# Altium schematic sheet INV.Main.SchDoc
size 1549 x 599 mm; SheetNumber: 2; SheetTotal: 3
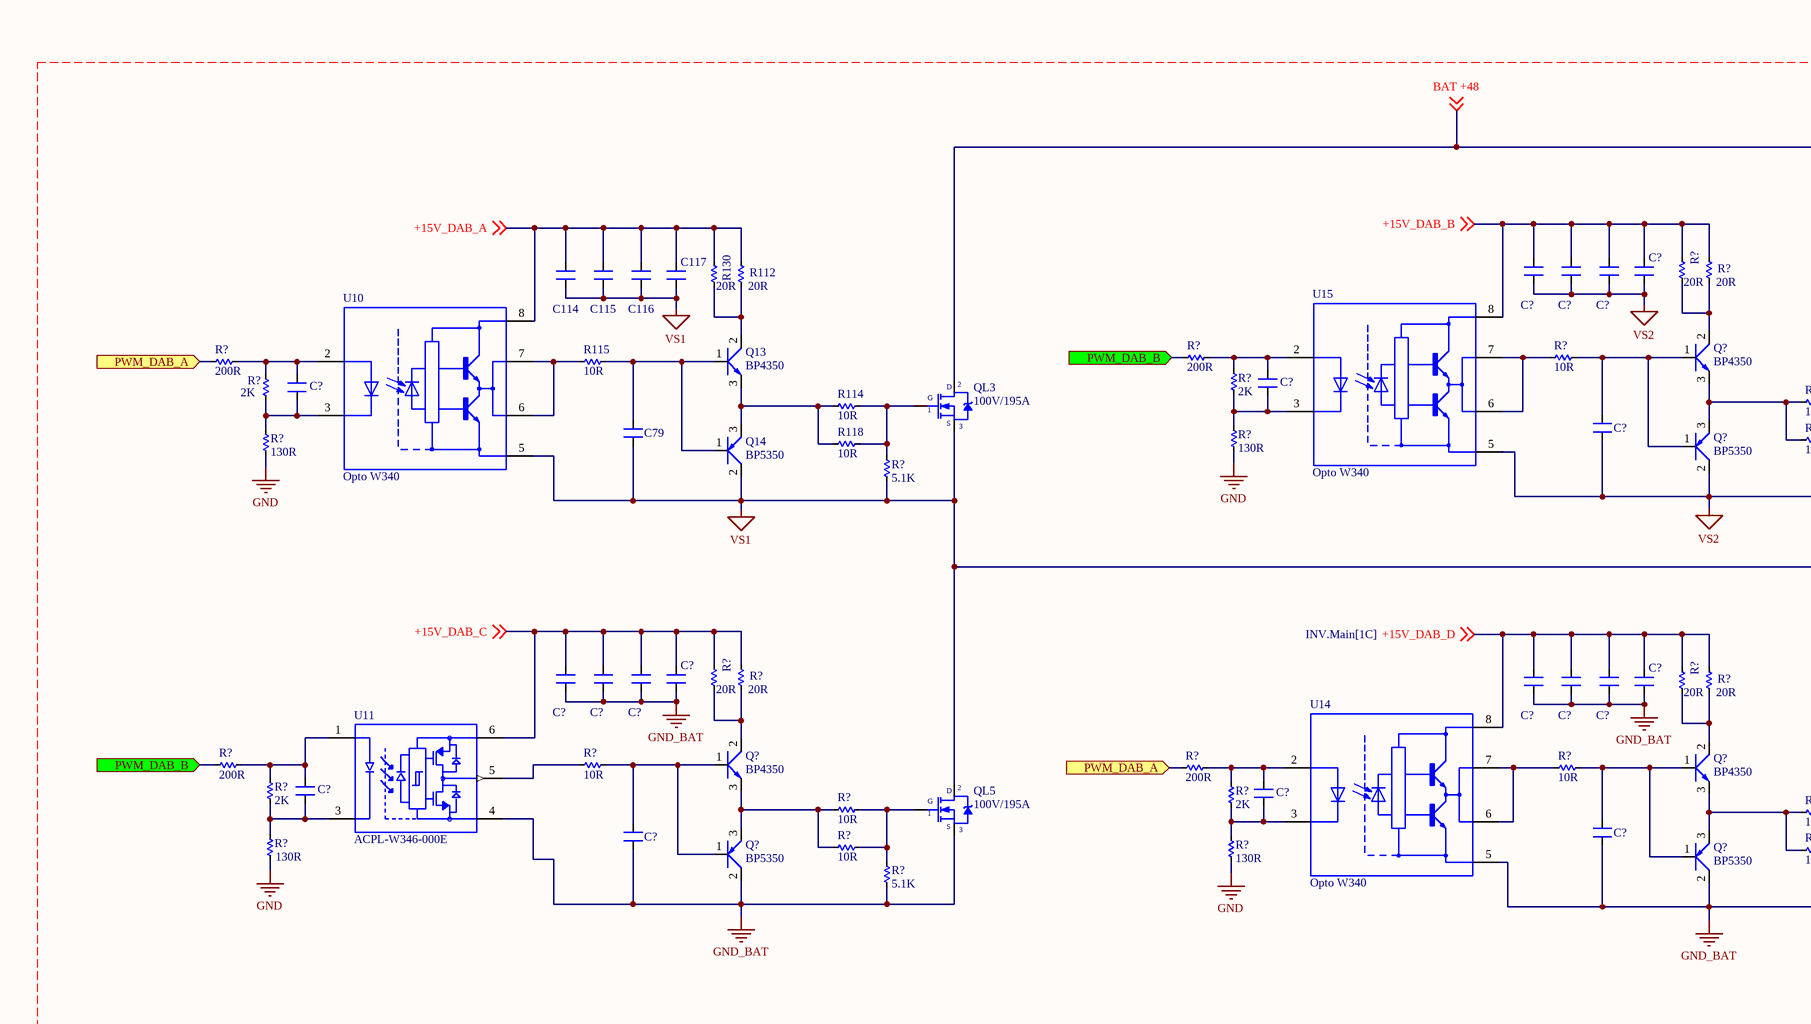
[diagram p0: INV.Main.SchDoc, top column 1 of 4]
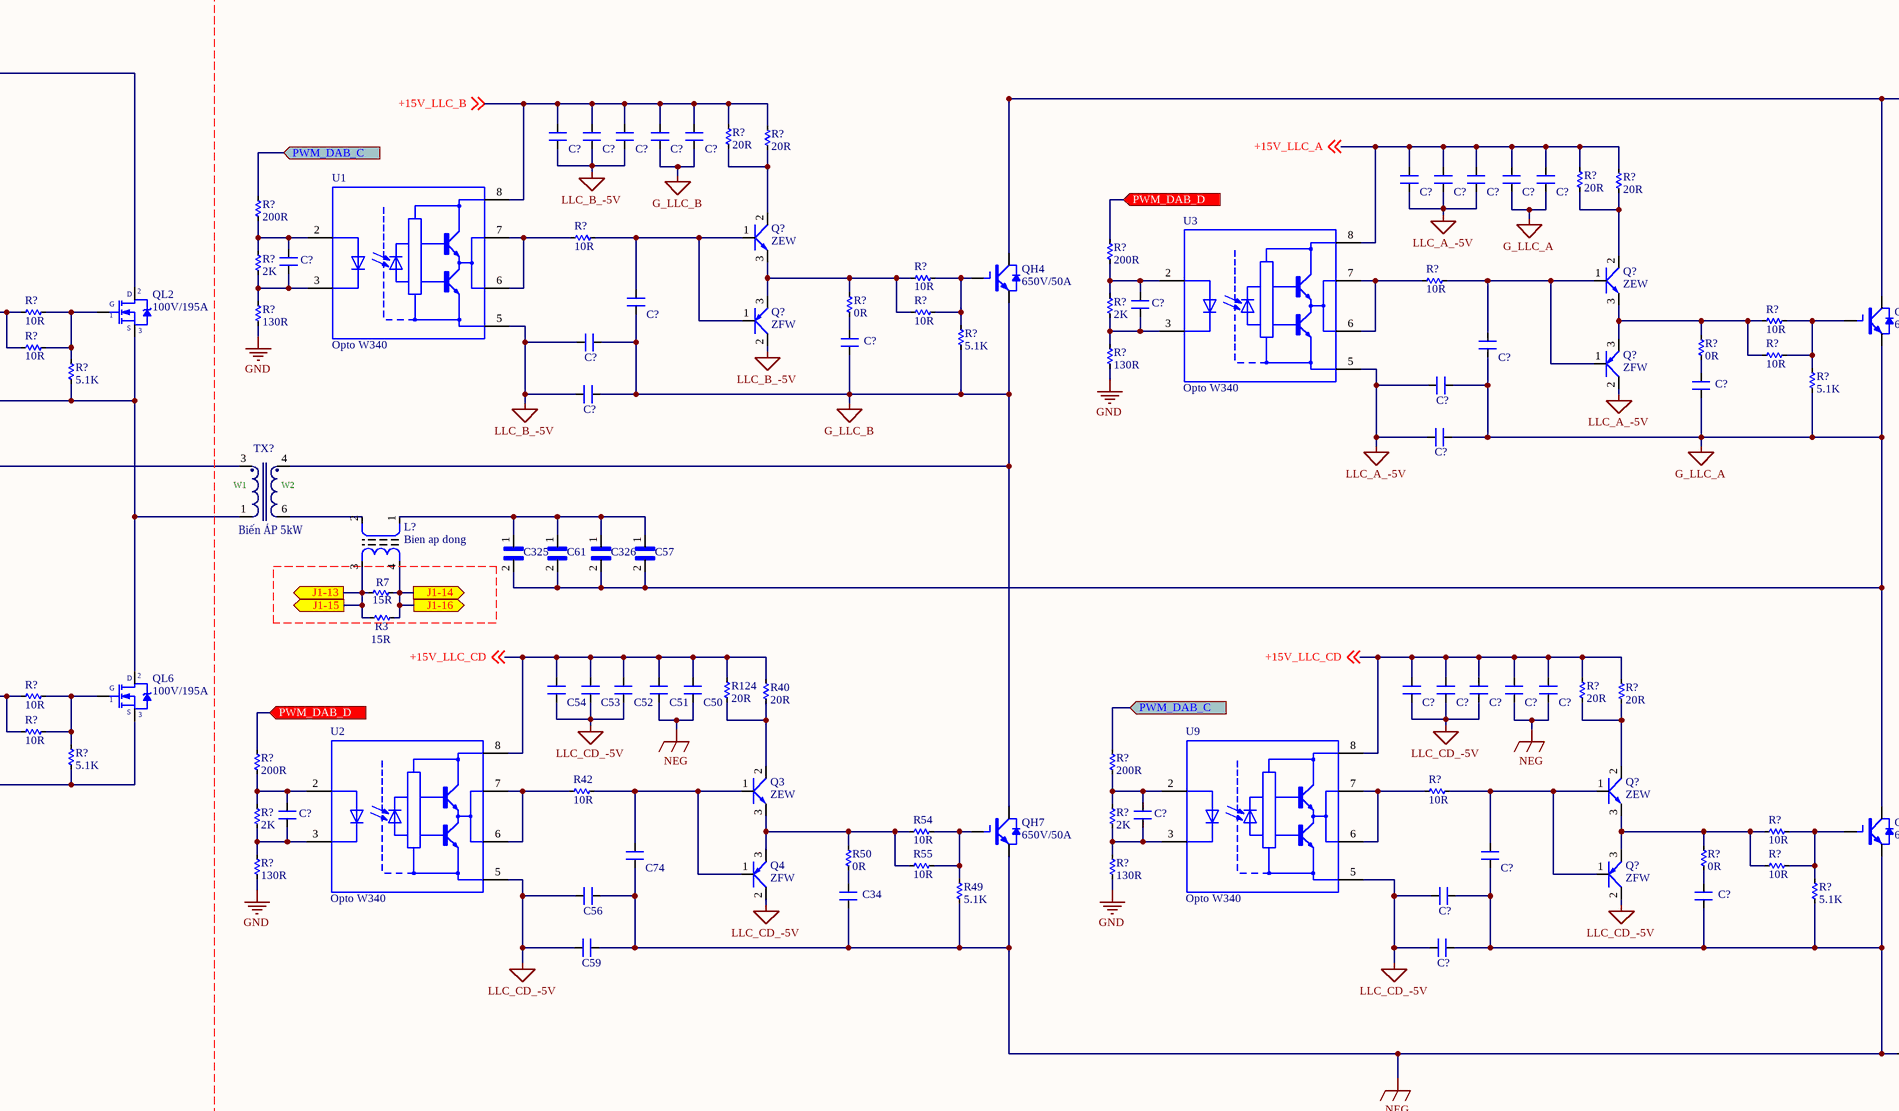
[diagram p1: INV.Main.SchDoc, top column 2 of 4]
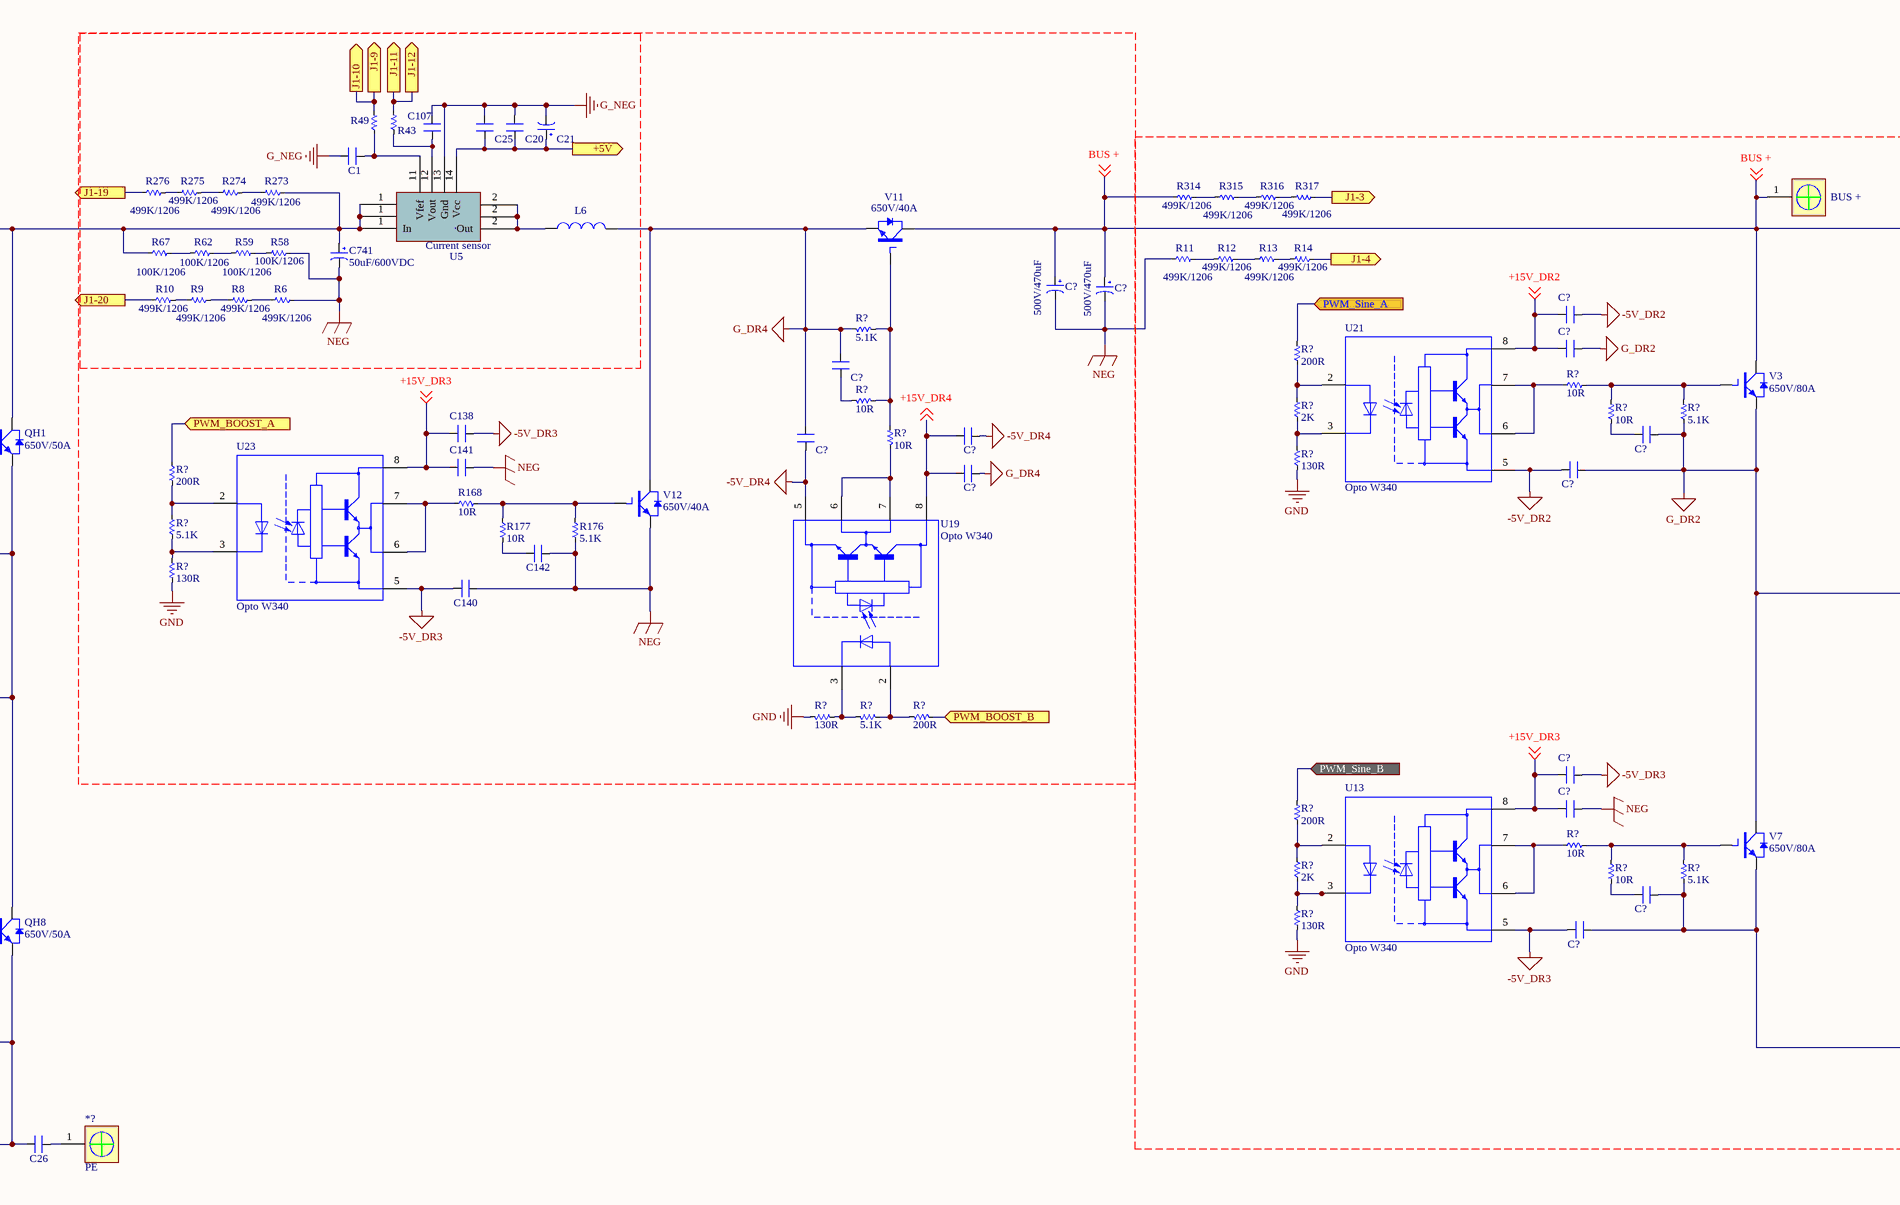
[diagram p2: INV.Main.SchDoc, top column 3 of 4]
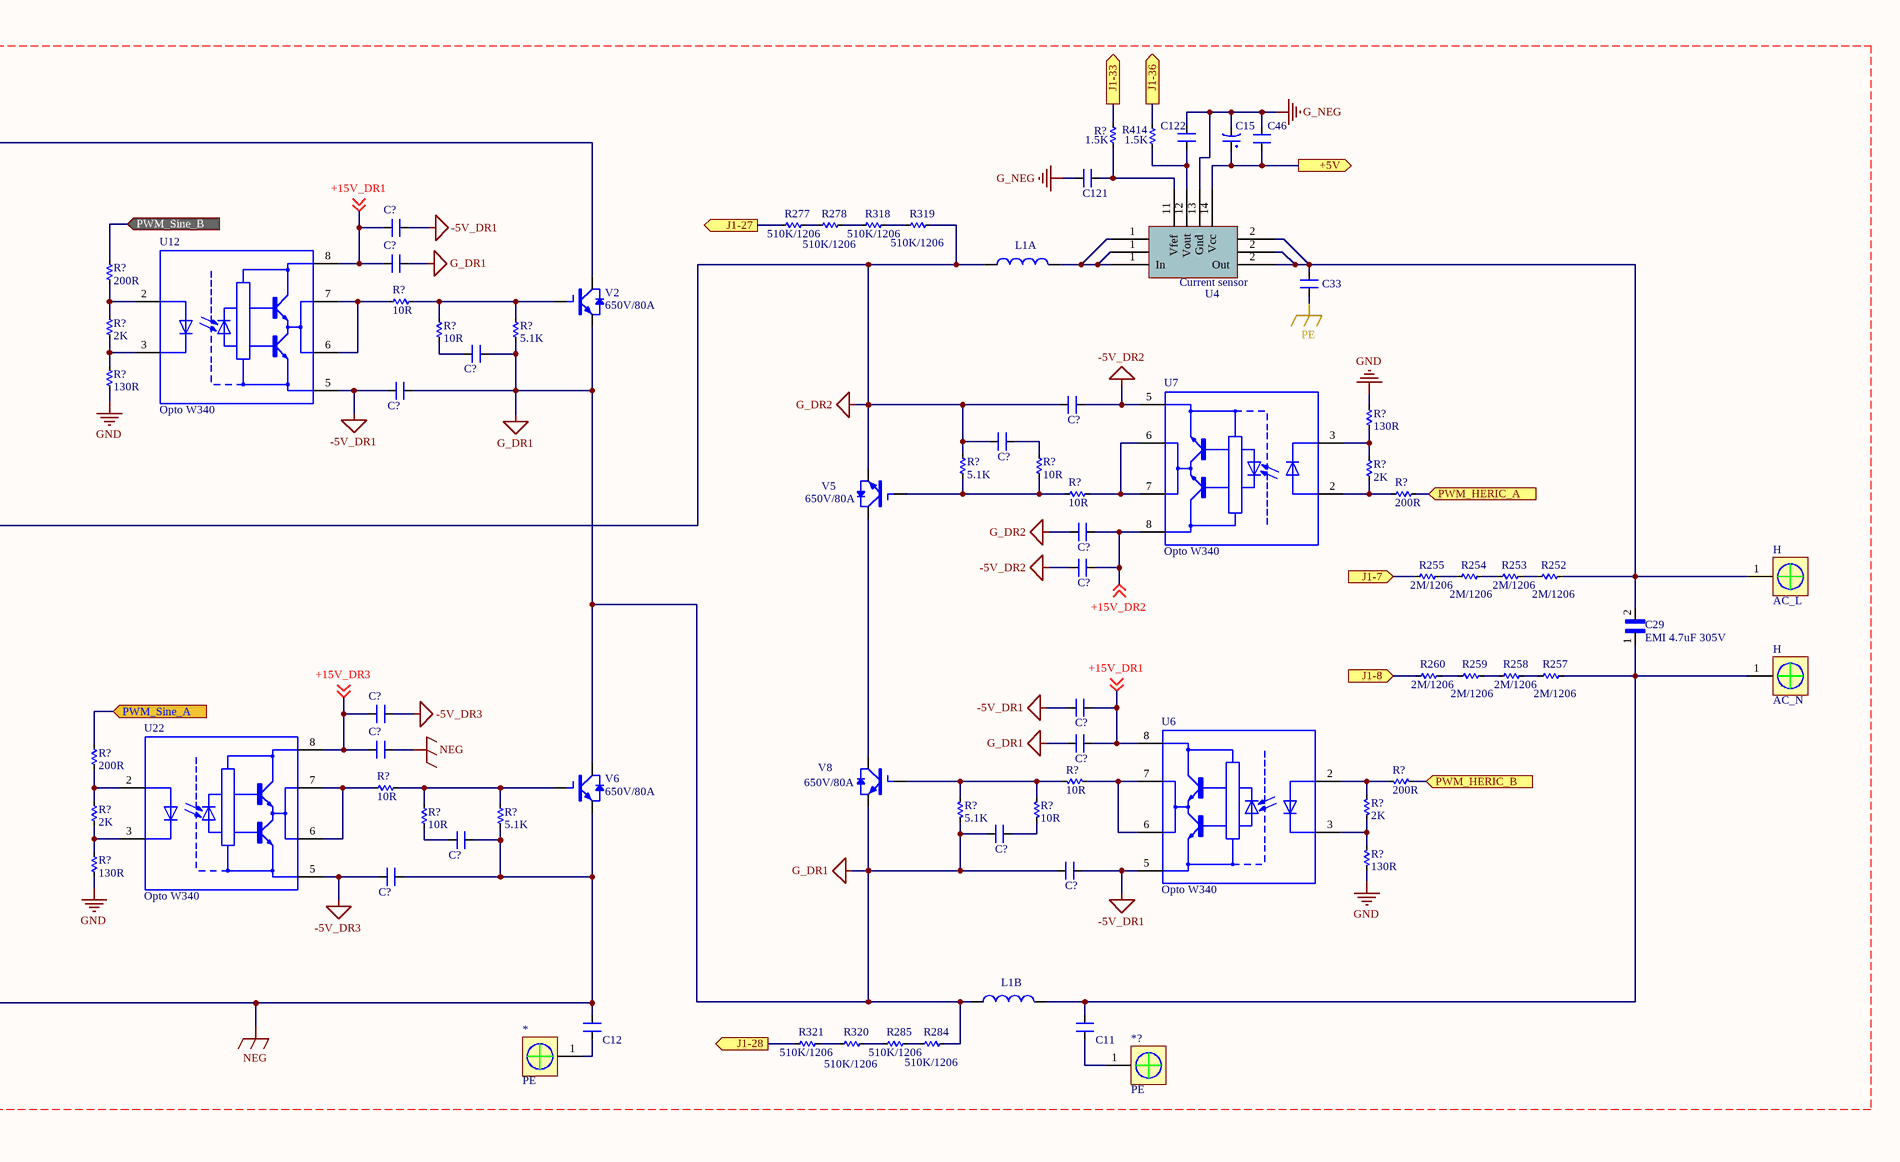
[diagram p3: INV.Main.SchDoc, top column 4 of 4]
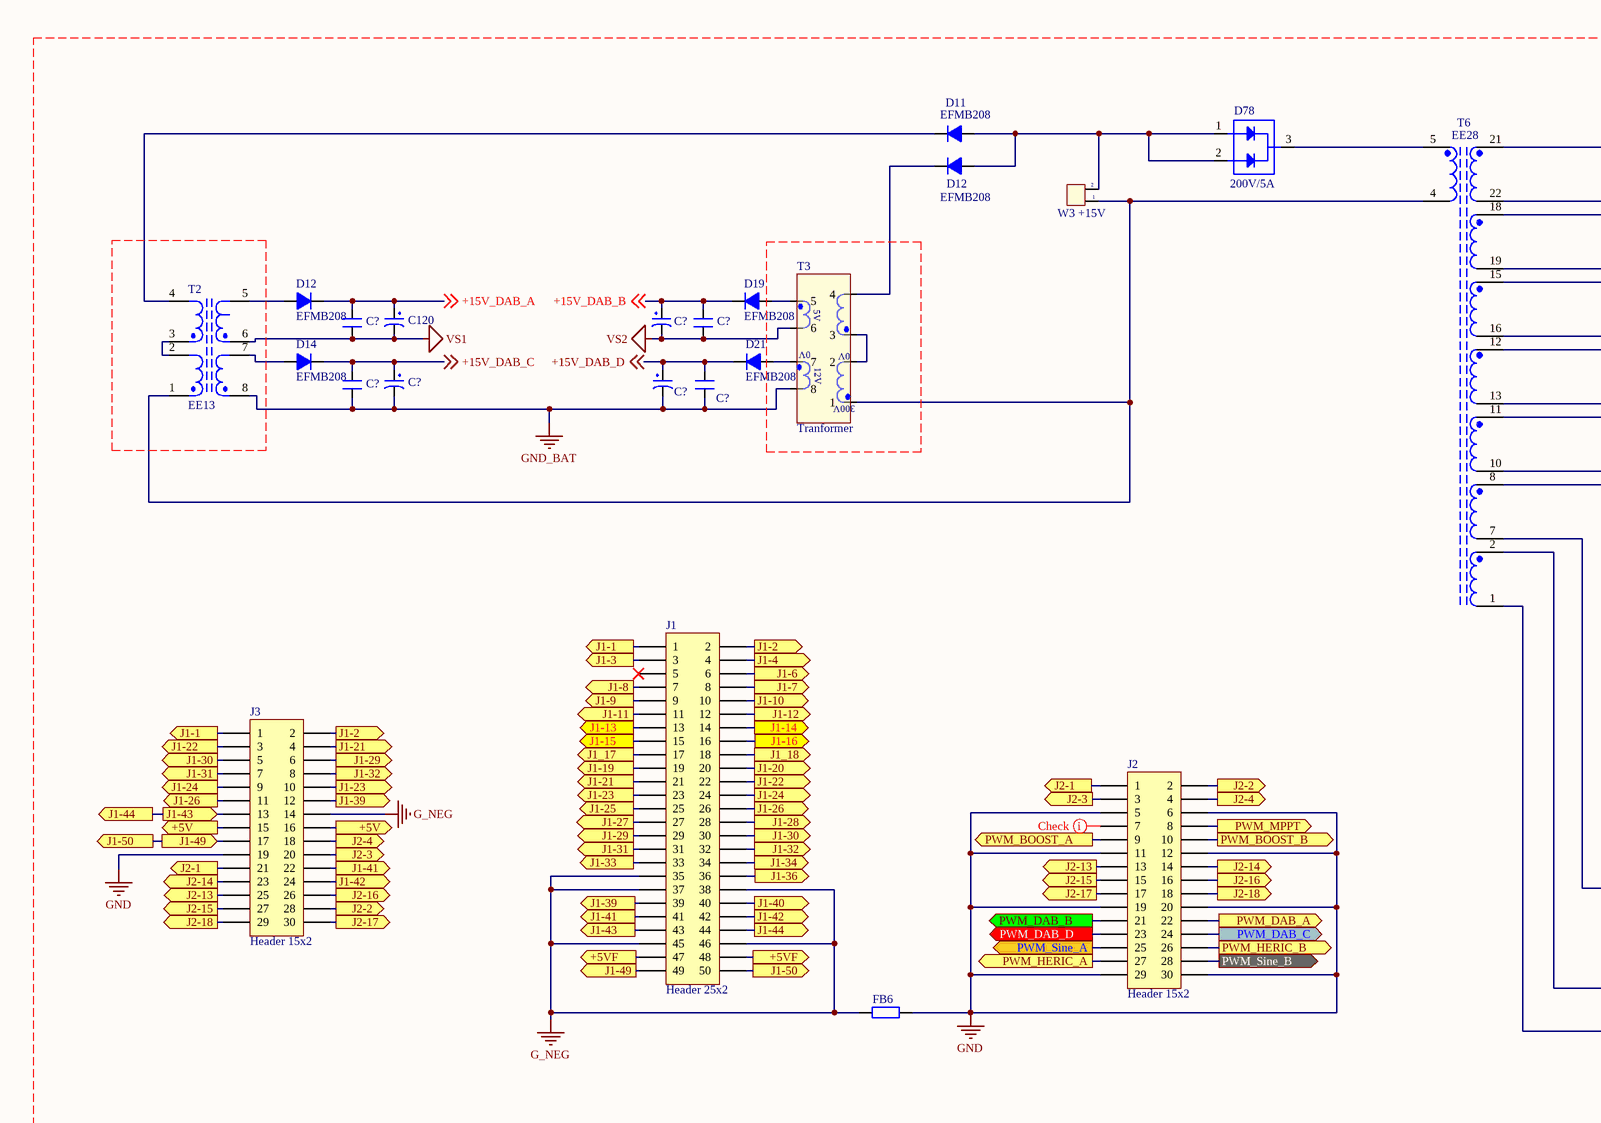
[diagram p4: INV.Main.SchDoc, bottom column 1 of 4]
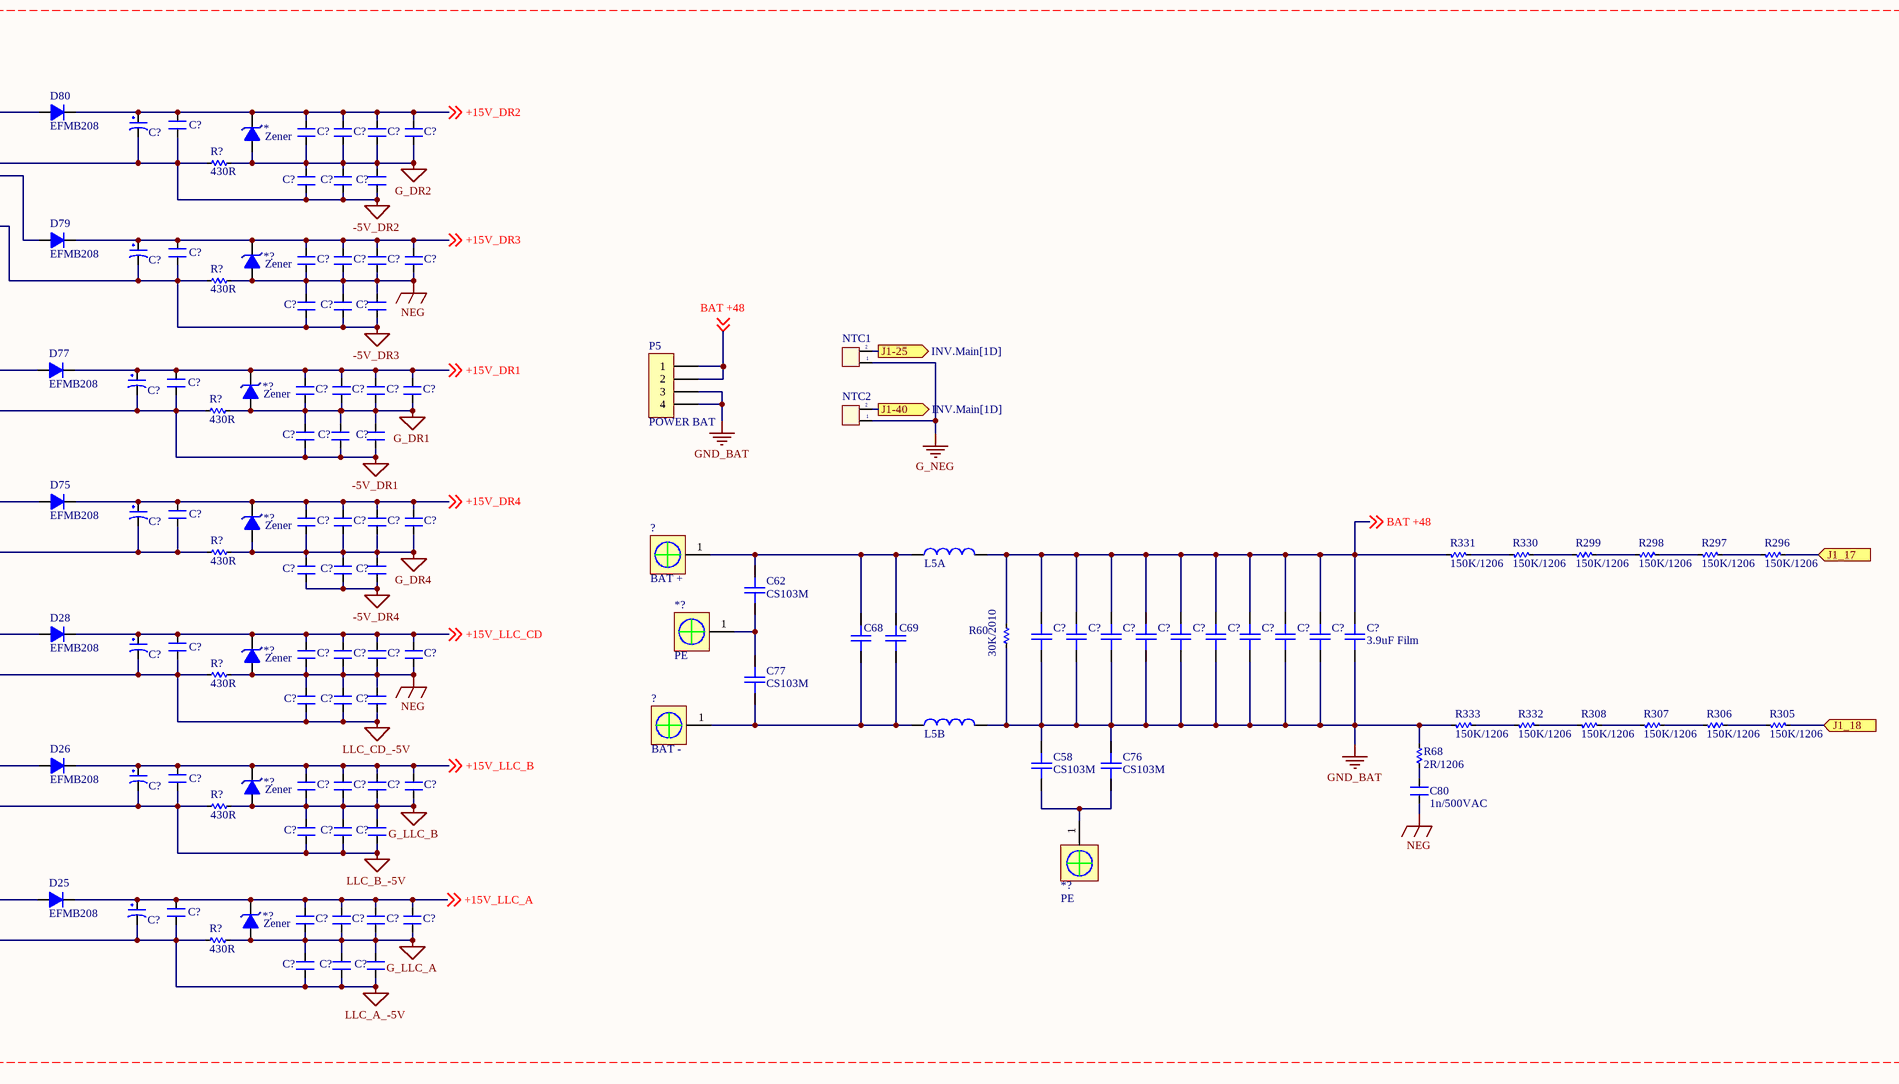
[diagram p5: INV.Main.SchDoc, bottom column 2 of 4]
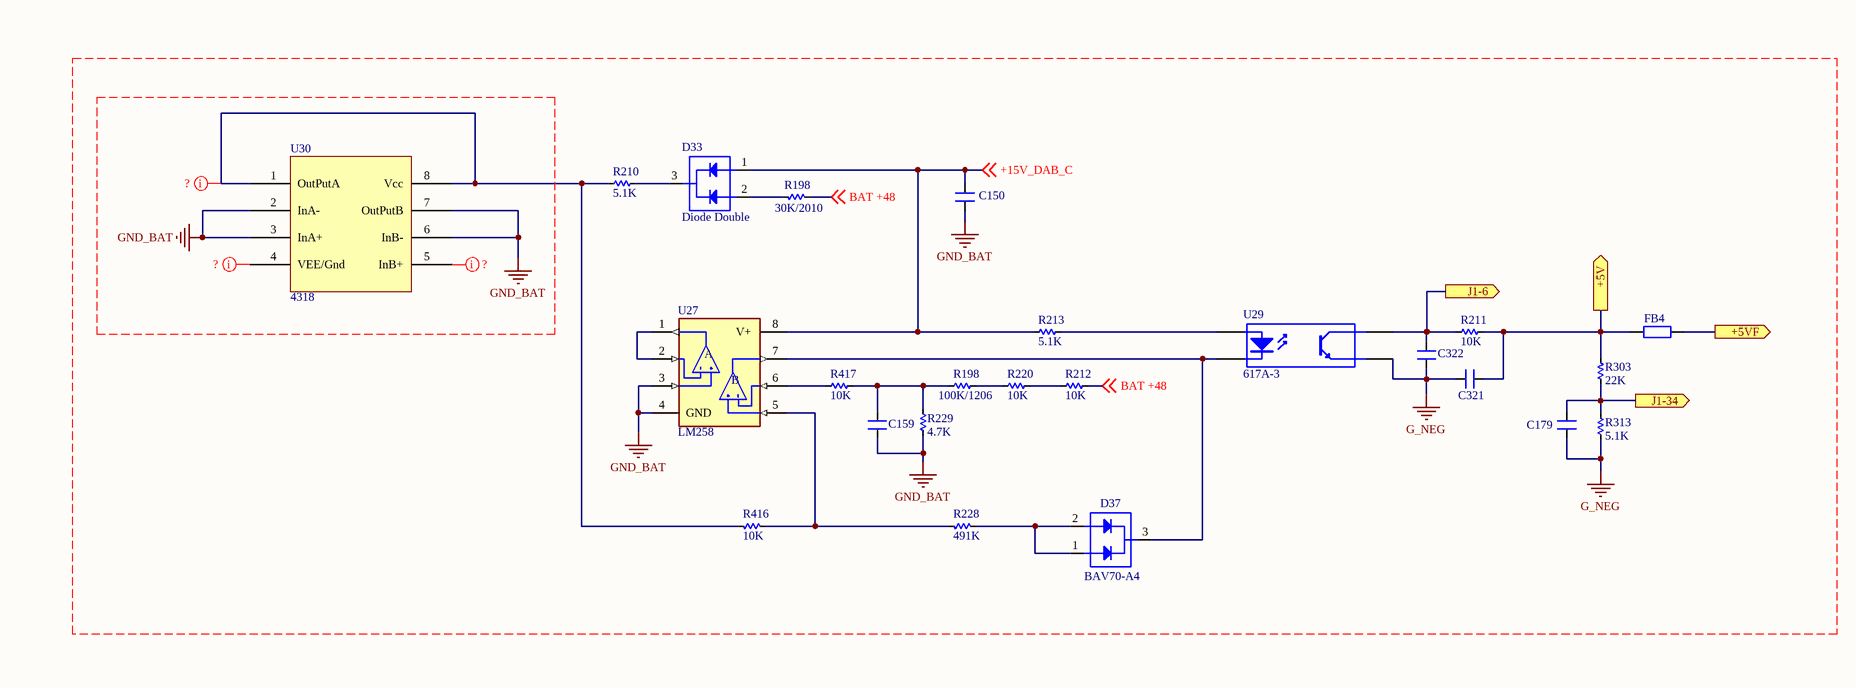
[diagram p6: INV.Main.SchDoc, bottom column 3 of 4]
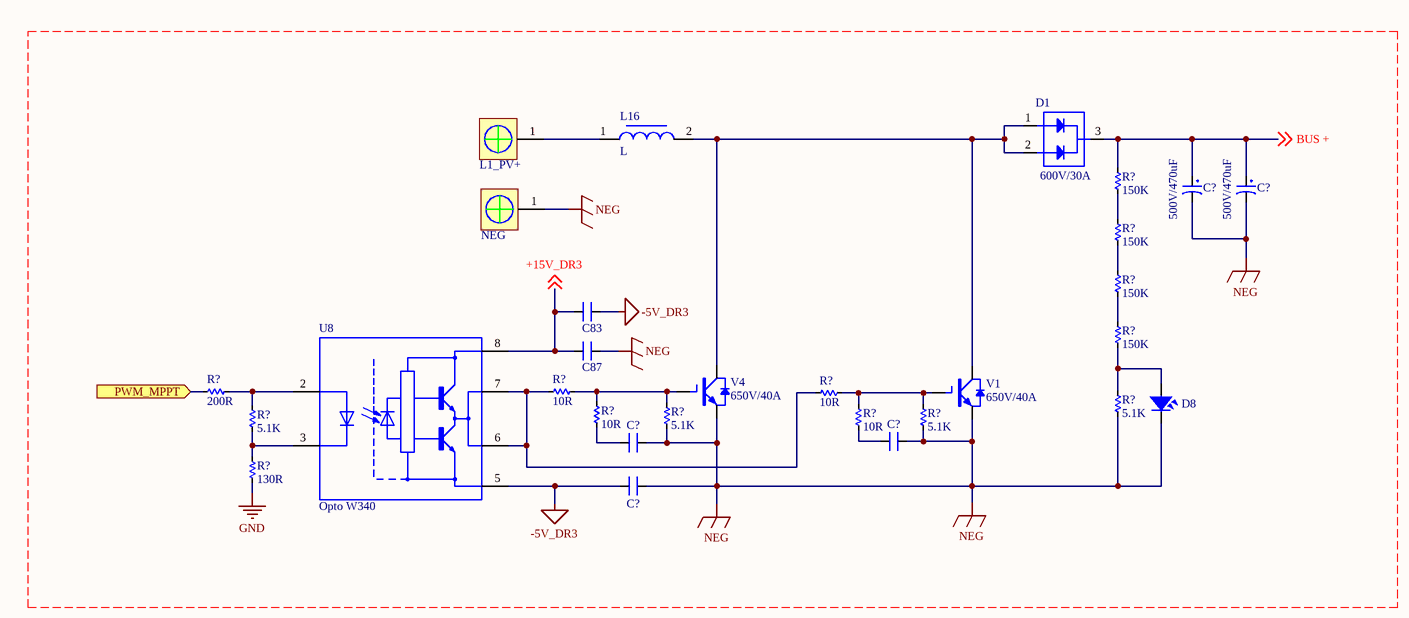
[diagram p7: INV.Main.SchDoc, bottom column 4 of 4]

## Parts
(Parts that share a designator on the sheet are numbered #1, #2 ... from top to bottom, then left to right.)
*#1  PE  [Copper Pipe]
*#2  Zener  [D1A]
*?#1  PE  [Copper Pipe]
*?#2  PE  [Copper Pipe]
*?#3  Zener  [D1A]
*?#4  Zener  [D1A]
*?#5  Zener  [D1A]
*?#6  PE  [Copper Pipe]
*?#7  Zener  [D1A]
*?#8  PE  [Copper Pipe]
*?#9  Zener  [D1A]
*?#10  Zener  [D1A]
?#1  BAT +  [Copper Pipe]
?#2  BAT -  [Copper Pipe]
C1  Tu dan gom  [Tu dan 0805]  (value not drawn)
C11  Tu dan gom  [Tu dan 0805]  (value not drawn)
C12  Tu dan gom  [Tu dan 0805]  (value not drawn)
C15  100uF/25V  [CAP-10X17-N]  (value not drawn)
C20  Tu dan gom  [Tu dan 0805]  (value not drawn)
C21  100uF/25V  [CAP-10X17-N]  (value not drawn)
C25  Tu dan gom  [Tu dan 0805]  (value not drawn)
C26  Tu dan gom  [Tu dan 0805]  (value not drawn)
C29  EMI 4.7uF 305V  [CAPRR2250W80L2600T850H1500]
C33  Tu dan gom  [Tu dan 0805]  (value not drawn)
C34  Tu dan gom  [Tu dan 0805]  (value not drawn)
C46  Tu dan gom  [Tu dan 0805]  (value not drawn)
C50  Tu dan gom  [Tu dan 0805]  (value not drawn)
C51  Tu dan gom  [Tu dan 0805]  (value not drawn)
C52  Tu dan gom  [Tu dan 0805]  (value not drawn)
C53  Tu dan gom  [Tu dan 0805]  (value not drawn)
C54  Tu dan gom  [Tu dan 0805]  (value not drawn)
C56  Tu dan gom  [Tu dan 0805]  (value not drawn)
C57  CBB 150nF/630V  [CAPRR2250W80L2600T850H1500]  (value not drawn)
C58  CS103M  [CAPC-0603 (1608)]
C59  Tu dan gom  [Tu dan 0805]  (value not drawn)
C61  CBB 150nF/630V  [CAPRR2250W80L2600T850H1500]  (value not drawn)
C62  CS103M  [CAPC-0603 (1608)]
C68  (no value)  [CAPC-0603 (1608)]
C69  (no value)  [CAPC-0603 (1608)]
C74  Tu dan gom  [Tu dan 0805]  (value not drawn)
C76  CS103M  [CAPC-0603 (1608)]
C77  CS103M  [CAPC-0603 (1608)]
C79  Tu dan gom  [Tu dan 0805]  (value not drawn)
C80  1n/500VAC  [Tu dan 0805]
C83  Tu dan gom  [Tu dan 0805]  (value not drawn)
C87  Tu dan gom  [Tu dan 0805]  (value not drawn)
C107  Tu dan gom  [Tu dan 0805]  (value not drawn)
C114  Tu dan gom  [Tu dan 0805]  (value not drawn)
C115  Tu dan gom  [Tu dan 0805]  (value not drawn)
C116  Tu dan gom  [Tu dan 0805]  (value not drawn)
C117  Tu dan gom  [Tu dan 0805]  (value not drawn)
C120  100uF/25V  [CAP-10X17-N]  (value not drawn)
C121  Tu dan gom  [Tu dan 0805]  (value not drawn)
C122  Tu dan gom  [Tu dan 0805]  (value not drawn)
C138  Tu dan gom  [Tu dan 0805]  (value not drawn)
C140  Tu dan gom  [Tu dan 0805]  (value not drawn)
C141  Tu dan gom  [Tu dan 0805]  (value not drawn)
C142  Tu dan gom  [Tu dan 0805]  (value not drawn)
C150  Tu dan gom  [Tu dan 0805]  (value not drawn)
C159  Tu dan gom  [Tu dan 0805]  (value not drawn)
C179  Tu dan gom  [Tu dan 0805]  (value not drawn)
C321  Tu dan gom  [Tu dan 0805]  (value not drawn)
C322  Tu dan gom  [Tu dan 0805]  (value not drawn)
C325  CBB 150nF/630V  [CAPRR2250W80L2600T850H1500]  (value not drawn)
C326  CBB 150nF/630V  [CAPRR2250W80L2600T850H1500]  (value not drawn)
C741  50uF/600VDC  [CAP-10X17-N]
C?#1  Tu dan gom  [Tu dan 0805]  (value not drawn)
C?#2  Tu dan gom  [Tu dan 0805]  (value not drawn)
C?#3  Tu dan gom  [Tu dan 0805]  (value not drawn)
C?#4  Tu dan gom  [Tu dan 0805]  (value not drawn)
C?#5  Tu dan gom  [Tu dan 0805]  (value not drawn)
C?#6  500V/470uF  [CAP-10X17-N]
C?#7  500V/470uF  [CAP-10X17-N]
C?#8  Tu dan gom  [Tu dan 0805]  (value not drawn)
C?#9  Tu dan gom  [Tu dan 0805]  (value not drawn)
C?#10  Tu dan gom  [Tu dan 0805]  (value not drawn)
C?#11  Tu dan gom  [Tu dan 0805]  (value not drawn)
C?#12  Tu dan gom  [Tu dan 0805]  (value not drawn)
C?#13  Tu dan gom  [Tu dan 0805]  (value not drawn)
C?#14  Tu dan gom  [Tu dan 0805]  (value not drawn)
C?#15  Tu dan gom  [Tu dan 0805]  (value not drawn)
C?#16  Tu dan gom  [Tu dan 0805]  (value not drawn)
C?#17  Tu dan gom  [Tu dan 0805]  (value not drawn)
C?#18  Tu dan gom  [Tu dan 0805]  (value not drawn)
C?#19  Tu dan gom  [Tu dan 0805]  (value not drawn)
C?#20  Tu dan gom  [Tu dan 0805]  (value not drawn)
C?#21  Tu dan gom  [Tu dan 0805]  (value not drawn)
C?#22  Tu dan gom  [Tu dan 0805]  (value not drawn)
C?#23  Tu dan gom  [Tu dan 0805]  (value not drawn)
C?#24  Tu dan gom  [Tu dan 0805]  (value not drawn)
C?#25  Tu dan gom  [Tu dan 0805]  (value not drawn)
C?#26  Tu dan gom  [Tu dan 0805]  (value not drawn)
C?#27  Tu dan gom  [Tu dan 0805]  (value not drawn)
C?#28  Tu dan gom  [Tu dan 0805]  (value not drawn)
C?#29  Tu dan gom  [Tu dan 0805]  (value not drawn)
C?#30  Tu dan gom  [Tu dan 0805]  (value not drawn)
C?#31  Tu dan gom  [Tu dan 0805]  (value not drawn)
C?#32  Tu dan gom  [Tu dan 0805]  (value not drawn)
C?#33  Tu dan gom  [Tu dan 0805]  (value not drawn)
C?#34  Tu dan gom  [Tu dan 0805]  (value not drawn)
C?#35  Tu dan gom  [Tu dan 0805]  (value not drawn)
C?#36  Tu dan gom  [Tu dan 0805]  (value not drawn)
C?#37  Tu dan gom  [Tu dan 0805]  (value not drawn)
C?#38  Tu dan gom  [Tu dan 0805]  (value not drawn)
C?#39  Tu dan gom  [Tu dan 0805]  (value not drawn)
C?#40  Tu dan gom  [Tu dan 0805]  (value not drawn)
C?#41  Tu dan gom  [Tu dan 0805]  (value not drawn)
C?#42  Tu dan gom  [Tu dan 0805]  (value not drawn)
C?#43  Tu dan gom  [Tu dan 0805]  (value not drawn)
C?#44  Tu dan gom  [Tu dan 0805]  (value not drawn)
C?#45  Tu dan gom  [Tu dan 0805]  (value not drawn)
C?#46  Tu dan gom  [Tu dan 0805]  (value not drawn)
C?#47  Tu dan gom  [Tu dan 0805]  (value not drawn)
C?#48  Tu dan gom  [Tu dan 0805]  (value not drawn)
C?#49  Tu dan gom  [Tu dan 0805]  (value not drawn)
C?#50  Tu dan gom  [Tu dan 0805]  (value not drawn)
C?#51  Tu dan gom  [Tu dan 0805]  (value not drawn)
C?#52  Tu dan gom  [Tu dan 0805]  (value not drawn)
C?#53  Tu dan gom  [Tu dan 0805]  (value not drawn)
C?#54  Tu dan gom  [Tu dan 0805]  (value not drawn)
C?#55  Tu dan gom  [Tu dan 0805]  (value not drawn)
C?#56  Tu dan gom  [Tu dan 0805]  (value not drawn)
C?#57  Tu dan gom  [Tu dan 0805]  (value not drawn)
C?#58  Tu dan gom  [Tu dan 0805]  (value not drawn)
C?#59  Tu dan gom  [Tu dan 0805]  (value not drawn)
C?#60  Tu dan gom  [Tu dan 0805]  (value not drawn)
C?#61  Tu dan gom  [Tu dan 0805]  (value not drawn)
C?#62  Tu dan gom  [Tu dan 0805]  (value not drawn)
C?#63  Tu dan gom  [Tu dan 0805]  (value not drawn)
C?#64  Tu dan gom  [Tu dan 0805]  (value not drawn)
C?#65  Tu dan gom  [Tu dan 0805]  (value not drawn)
C?#66  Tu dan gom  [Tu dan 0805]  (value not drawn)
C?#67  Tu dan gom  [Tu dan 0805]  (value not drawn)
C?#68  Tu dan gom  [Tu dan 0805]  (value not drawn)
C?#69  Tu dan gom  [Tu dan 0805]  (value not drawn)
C?#70  Tu dan gom  [Tu dan 0805]  (value not drawn)
C?#71  Tu dan gom  [Tu dan 0805]  (value not drawn)
C?#72  Tu dan gom  [Tu dan 0805]  (value not drawn)
C?#73  Tu dan gom  [Tu dan 0805]  (value not drawn)
C?#74  Tu dan gom  [Tu dan 0805]  (value not drawn)
C?#75  Tu dan gom  [Tu dan 0805]  (value not drawn)
C?#76  Tu dan gom  [Tu dan 0805]  (value not drawn)
C?#77  Tu dan gom  [Tu dan 0805]  (value not drawn)
C?#78  Tu dan gom  [Tu dan 0805]  (value not drawn)
C?#79  Tu dan gom  [Tu dan 0805]  (value not drawn)
C?#80  Tu dan gom  [Tu dan 0805]  (value not drawn)
C?#81  100uF/25V  [CAP-10X17-N]  (value not drawn)
C?#82  Tu dan gom  [Tu dan 0805]  (value not drawn)
C?#83  Tu dan gom  [Tu dan 0805]  (value not drawn)
C?#84  Tu dan gom  [Tu dan 0805]  (value not drawn)
C?#85  Tu dan gom  [Tu dan 0805]  (value not drawn)
C?#86  Tu dan gom  [Tu dan 0805]  (value not drawn)
C?#87  Tu dan gom  [Tu dan 0805]  (value not drawn)
C?#88  Tu dan gom  [Tu dan 0805]  (value not drawn)
C?#89  Tu dan gom  [Tu dan 0805]  (value not drawn)
C?#90  100uF/25V  [CAP-10X17-N]  (value not drawn)
C?#91  Tu dan gom  [Tu dan 0805]  (value not drawn)
C?#92  Tu dan gom  [Tu dan 0805]  (value not drawn)
C?#93  Tu dan gom  [Tu dan 0805]  (value not drawn)
C?#94  Tu dan gom  [Tu dan 0805]  (value not drawn)
C?#95  Tu dan gom  [Tu dan 0805]  (value not drawn)
C?#96  Tu dan gom  [Tu dan 0805]  (value not drawn)
C?#97  100uF/25V  [CAP-10X17-N]  (value not drawn)
C?#98  Tu dan gom  [Tu dan 0805]  (value not drawn)
C?#99  Tu dan gom  [Tu dan 0805]  (value not drawn)
C?#100  Tu dan gom  [Tu dan 0805]  (value not drawn)
C?#101  Tu dan gom  [Tu dan 0805]  (value not drawn)
C?#102  Tu dan gom  [Tu dan 0805]  (value not drawn)
C?#103  100uF/25V  [CAP-10X17-N]  (value not drawn)
C?#104  100uF/25V  [CAP-10X17-N]  (value not drawn)
C?#105  Tu dan gom  [Tu dan 0805]  (value not drawn)
C?#106  500V/470uF  [CAP-10X17-N]
C?#107  500V/470uF  [CAP-10X17-N]
C?#108  100uF/25V  [CAP-10X17-N]  (value not drawn)
C?#109  Tu dan gom  [Tu dan 0805]  (value not drawn)
C?#110  Tu dan gom  [Tu dan 0805]  (value not drawn)
C?#111  Tu dan gom  [Tu dan 0805]  (value not drawn)
C?#112  Tu dan gom  [Tu dan 0805]  (value not drawn)
C?#113  Tu dan gom  [Tu dan 0805]  (value not drawn)
C?#114  Tu dan gom  [Tu dan 0805]  (value not drawn)
C?#115  Tu dan gom  [Tu dan 0805]  (value not drawn)
C?#116  Tu dan gom  [Tu dan 0805]  (value not drawn)
C?#117  Tu dan gom  [Tu dan 0805]  (value not drawn)
C?#118  100uF/25V  [CAP-10X17-N]  (value not drawn)
C?#119  Tu dan gom  [Tu dan 0805]  (value not drawn)
C?#120  Tu dan gom  [Tu dan 0805]  (value not drawn)
C?#121  Tu dan gom  [Tu dan 0805]  (value not drawn)
C?#122  Tu dan gom  [Tu dan 0805]  (value not drawn)
C?#123  Tu dan gom  [Tu dan 0805]  (value not drawn)
C?#124  Tu dan gom  [Tu dan 0805]  (value not drawn)
C?#125  Tu dan gom  [Tu dan 0805]  (value not drawn)
C?#126  Tu dan gom  [Tu dan 0805]  (value not drawn)
C?#127  Tu dan gom  [Tu dan 0805]  (value not drawn)
C?#128  Tu dan gom  [Tu dan 0805]  (value not drawn)
C?#129  3.9uF Film  [CAPC-0603 (1608)]  (value not drawn)
C?#130  395K  [CAPC-0603 (1608)]  (value not drawn)
C?#131  395K  [CAPC-0603 (1608)]  (value not drawn)
C?#132  395K  [CAPC-0603 (1608)]  (value not drawn)
C?#133  395K  [CAPC-0603 (1608)]  (value not drawn)
C?#134  395K  [CAPC-0603 (1608)]  (value not drawn)
C?#135  395K  [CAPC-0603 (1608)]  (value not drawn)
C?#136  395K  [CAPC-0603 (1608)]  (value not drawn)
C?#137  395K  [CAPC-0603 (1608)]  (value not drawn)
C?#138  3.9uF Film  [CAPC-0603 (1608)]
C?#139  Tu dan gom  [Tu dan 0805]  (value not drawn)
C?#140  100uF/25V  [CAP-10X17-N]  (value not drawn)
C?#141  Tu dan gom  [Tu dan 0805]  (value not drawn)
C?#142  Tu dan gom  [Tu dan 0805]  (value not drawn)
C?#143  Tu dan gom  [Tu dan 0805]  (value not drawn)
C?#144  Tu dan gom  [Tu dan 0805]  (value not drawn)
C?#145  Tu dan gom  [Tu dan 0805]  (value not drawn)
C?#146  Tu dan gom  [Tu dan 0805]  (value not drawn)
C?#147  Tu dan gom  [Tu dan 0805]  (value not drawn)
C?#148  Tu dan gom  [Tu dan 0805]  (value not drawn)
C?#149  100uF/25V  [CAP-10X17-N]  (value not drawn)
C?#150  Tu dan gom  [Tu dan 0805]  (value not drawn)
C?#151  Tu dan gom  [Tu dan 0805]  (value not drawn)
C?#152  Tu dan gom  [Tu dan 0805]  (value not drawn)
C?#153  Tu dan gom  [Tu dan 0805]  (value not drawn)
C?#154  Tu dan gom  [Tu dan 0805]  (value not drawn)
C?#155  Tu dan gom  [Tu dan 0805]  (value not drawn)
C?#156  Tu dan gom  [Tu dan 0805]  (value not drawn)
C?#157  Tu dan gom  [Tu dan 0805]  (value not drawn)
C?#158  100uF/25V  [CAP-10X17-N]  (value not drawn)
C?#159  Tu dan gom  [Tu dan 0805]  (value not drawn)
C?#160  Tu dan gom  [Tu dan 0805]  (value not drawn)
C?#161  Tu dan gom  [Tu dan 0805]  (value not drawn)
C?#162  Tu dan gom  [Tu dan 0805]  (value not drawn)
C?#163  Tu dan gom  [Tu dan 0805]  (value not drawn)
C?#164  Tu dan gom  [Tu dan 0805]  (value not drawn)
C?#165  Tu dan gom  [Tu dan 0805]  (value not drawn)
D1  600V/30A  [DIO_STTH2003CG-TR]
D8  LED  [LED 2835 NEW]  (value not drawn)
D11  EFMB208  [1N4148]
D12#1  EFMB208  [1N4148]
D12#2  EFMB208  [1N4148]
D14  EFMB208  [1N4148]
D19  EFMB208  [1N4148]
D21  EFMB208  [1N4148]
D25  EFMB208  [1N4148]
D26  EFMB208  [1N4148]
D28  EFMB208  [1N4148]
D33  Diode Double  [DIO_STTH2003CG-TR]
D37  BAV70-A4  [DIO_STTH2003CG-TR]
D75  EFMB208  [1N4148]
D77  EFMB208  [1N4148]
D78  200V/5A  [DIO_STTH2003CG-TR]
D79  EFMB208  [1N4148]
D80  EFMB208  [1N4148]
FB4  (no value)  [RESC-0603 (1608)]
FB6  (no value)  [RESC-0603 (1608)]
H#1  AC_L  [Copper Pipe]
H#2  AC_N  [Copper Pipe]
J1  Header 25x2  [Head 1X16 - CAI THANG]
J2  Header 15x2  [Head 1X16 - CAI THANG]
J3  Header 15x2  [Head 1X16 - CAI THANG]
J?  W3 +15V  [Jump2]
L1A  Cuộn L  [IND_1210]  (value not drawn)
L1B  Cuộn L  [IND_1210]  (value not drawn)
L5A  Cuộn L  [IND_1210]  (value not drawn)
L5B  Cuộn L  [IND_1210]  (value not drawn)
L6  Cuộn L  [IND_1210]  (value not drawn)
L16  L  [Cuan Cam PWM Hybrid]
L?  Bien ap dong  [Bien ap do Current]
NTC1  Temp Sensor  [Jump2]  (value not drawn)
NTC2  Temp Sensor  [Jump2]  (value not drawn)
P5  POWER BAT  [XH2.54M-4]
PV_+?#1  BUS +  [Copper Pipe]
PV_+?#2  L1_PV+  [Copper Pipe]
PV_+?#3  NEG  [Copper Pipe]
Q3  ZEW
Q4  ZFW  [QTO-92]
Q13  BP4350
Q14  BP5350  [QTO-92]
Q?#1  ZEW
Q?#2  BP4350
Q?#3  ZEW
Q?#4  ZFW  [QTO-92]
Q?#5  BP5350  [QTO-92]
Q?#6  ZFW  [QTO-92]
Q?#7  BP4350
Q?#8  BP4350
Q?#9  BP5350  [QTO-92]
Q?#10  BP5350  [QTO-92]
Q?#11  ZEW
Q?#12  ZFW  [QTO-92]
QH1  650V/50A  [TO-3P]
QH4  650V/50A  [TO-3P]
QH7  650V/50A  [TO-3P]
QH8  650V/50A  [TO-3P]
QL2  100V/195A  [TO220H1]
QL3  100V/195A  [TO220H1]
QL5  100V/195A  [TO220H1]
QL6  100V/195A  [TO220H1]
R3  15R  [R1206]
R6  499K/1206  [R1206]
R7  15R  [R1206]
R8  499K/1206  [R1206]
R9  499K/1206  [R1206]
R10  499K/1206  [R1206]
R11  499K/1206  [R1206]
R12  499K/1206  [R1206]
R13  499K/1206  [R1206]
R14  499K/1206  [R1206]
R40  20R  [R1206]
R42  10R  [R1206]
R43  499R/0603  [R1206]  (value not drawn)
R49#1  499R/0603  [R1206]  (value not drawn)
R49#2  5.1K  [R0805]
R50  0R  [R1206]
R54  10R  [R1206]
R55  10R  [R1206]
R58  100K/1206  [R1206]
R59  100K/1206  [R1206]
R60  30K/2010  [R1206]
R62  100K/1206  [R1206]
R67  100K/1206  [R1206]
R68  2R/1206  [R0805]
R112  20R  [R1206]
R114  10R  [R1206]
R115  10R  [R1206]
R118  10R  [R1206]
R124  20R  [R1206]
R130  20R  [R1206]
R168  10R  [R1206]
R176  5.1K  [R1206]
R177  10R  [R1206]
R198#1  30K/2010  [R0805]
R198#2  100K/1206  [R0805]
R210  5.1K  [R0805]
R211  10K  [R0805]
R212  10K  [R0805]
R213  5.1K  [R0805]
R220  10K  [R0805]
R228  491K  [R0805]
R229  4.7K  [R0805]
R252  2M/1206  [R1206]
R253  2M/1206  [R1206]
R254  2M/1206  [R1206]
R255  2M/1206  [R1206]
R257  2M/1206  [R1206]
R258  2M/1206  [R1206]
R259  2M/1206  [R1206]
R260  2M/1206  [R1206]
R273  499K/1206  [R1206]
R274  499K/1206  [R1206]
R275  499K/1206  [R1206]
R276  499K/1206  [R1206]
R277  510K/1206  [R1206]
R278  510K/1206  [R1206]
R284  510K/1206  [R1206]
R285  510K/1206  [R1206]
R296  150K/1206  [R0805]
R297  150K/1206  [R0805]
R298  150K/1206  [R0805]
R299  150K/1206  [R0805]
R303  22K  [R0805]
R305  150K/1206  [R0805]
R306  150K/1206  [R0805]
R307  150K/1206  [R0805]
R308  150K/1206  [R0805]
R313  5.1K  [R0805]
R314  499K/1206  [R1206]
R315  499K/1206  [R1206]
R316  499K/1206  [R1206]
R317  499K/1206  [R1206]
R318  510K/1206  [R1206]
R319  510K/1206  [R1206]
R320  510K/1206  [R1206]
R321  510K/1206  [R1206]
R330  150K/1206  [R0805]
R331  150K/1206  [R0805]
R332  150K/1206  [R0805]
R333  150K/1206  [R0805]
R414  1.5K  [R1206]
R416  10K  [R0805]
R417  10K  [R0805]
R?#1  1.5K  [R1206]
R?#2  20R  [R1206]
R?#3  20R  [R1206]
R?#4  20R  [R1206]
R?#5  20R  [R1206]
R?#6  20R  [R1206]
R?#7  20R  [R1206]
R?#8  5.1K  [R1206]
R?#9  200R  [R1206]
R?#10  200R  [R1206]
R?#11  200R  [R1206]
R?#12  10R  [R1206]
R?#13  200R  [R1206]
R?#14  10R  [R1206]
R?#15  2K  [R1206]
R?#16  10R  [R1206]
R?#17  200R  [R1206]
R?#18  200R  [R1206]
R?#19  10R  [R1206]
R?#20  10R  [R1206]
R?#21  10R  [R1206]
R?#22  10R  [R1206]
R?#23  2K  [R1206]
R?#24  2K  [R1206]
R?#25  10R  [R1206]
R?#26  5.1K  [R1206]
R?#27  2K  [R1206]
R?#28  10R  [R1206]
R?#29  5.1K  [R1206]
R?#30  2K  [R1206]
R?#31  0R  [R1206]
R?#32  2K  [R1206]
R?#33  10R  [R1206]
R?#34  130R  [R1206]
R?#35  10R  [R1206]
R?#36  10R  [R1206]
R?#37  10R  [R1206]
R?#38  130R  [R1206]
R?#39  5.1K  [R0805]
R?#40  130R  [R1206]
R?#41  130R  [R1206]
R?#42  130R  [R1206]
R?#43  10R  [R1206]
R?#44  0R  [R1206]
R?#45  130R  [R1206]
R?#46  10R  [R1206]
R?#47  200R  [R1206]
R?#48  5.1K  [R0805]
R?#49  5.1K  [R0805]
R?#50  130R  [R1206]
R?#51  5.1K  [R0805]
R?#52  5.1K  [R1206]
R?#53  5.1K  [R1206]
R?#54  10R  [R1206]
R?#55  2K  [R1206]
R?#56  10R  [R1206]
R?#57  200R  [R1206]
R?#58  130R  [R1206]
R?#59  20R  [R1206]
R?#60  20R  [R1206]
R?#61  20R  [R1206]
R?#62  20R  [R1206]
R?#63  130R  [R1206]
R?#64  5.1K  [R1206]
R?#65  200R  [R1206]
R?#66  200R  [R0805]
R?#67  10R  [R1206]
R?#68  200R  [R1206]
R?#69  10R  [R1206]
R?#70  2K  [R1206]
R?#71  2K  [R1206]
R?#72  20R  [R1206]
R?#73  20R  [R1206]
R?#74  10R  [R1206]
R?#75  10R  [R1206]
R?#76  200R  [R1206]
R?#77  200R  [R1206]
R?#78  130R  [R1206]
R?#79  10R  [R1206]
R?#80  130R  [R1206]
R?#81  10R  [R1206]
R?#82  10R  [R1206]
R?#83  200R  [R1206]
R?#84  10R  [R1206]
R?#85  10R  [R1206]
R?#86  5.1K  [R0805]
R?#87  5.1K  [R0805]
R?#88  200R  [R1206]
R?#89  200R  [R1206]
R?#90  5.1K  [R1206]
R?#91  10R  [R1206]
R?#92  2K  [R1206]
R?#93  2K  [R1206]
R?#94  2K  [R1206]
R?#95  10R  [R1206]
R?#96  5.1K  [R1206]
R?#97  10R  [R1206]
R?#98  5.1K  [R1206]
R?#99  10R  [R1206]
R?#100  130R  [R1206]
R?#101  2K  [R1206]
R?#102  2K  [R1206]
R?#103  130R  [R1206]
R?#104  130R  [R1206]
R?#105  10R  [R1206]
R?#106  0R  [R1206]
R?#107  130R  [R1206]
R?#108  130R  [R1206]
R?#109  10R  [R1206]
R?#110  5.1K  [R0805]
R?#111  430R  [R1206]
R?#112  430R  [R1206]
R?#113  150K  [R1206]
R?#114  150K  [R1206]
R?#115  430R  [R1206]
R?#116  150K  [R1206]
R?#117  150K  [R1206]
R?#118  200R  [R1206]
R?#119  10R  [R1206]
R?#120  10R  [R1206]
R?#121  5.1K  [R1206]
R?#122  430R  [R1206]
R?#123  10R  [R1206]
R?#124  5.1K  [R1206]
R?#125  5.1K  [R1206]
R?#126  10R  [R1206]
R?#127  5.1K  [R1206]
R?#128  130R  [R1206]
R?#129  430R  [R1206]
R?#130  430R  [R1206]
R?#131  430R  [R1206]
T2  EE13  [BAX_DVD3]
T3  Tranformer  [EE25]
T6  EE28
TX?  Biến ÁP 5kW  [EE13/7/4-Vertical/(EF12.6)]
U1  Opto W340  [DIP762W50P254L977H451Q8]
U2  Opto W340  [DIP762W50P254L977H451Q8]
U3  Opto W340  [DIP762W50P254L977H451Q8]
U4  Current sensor  [Bien ap do Current]
U5  Current sensor  [Bien ap do Current]
U6  Opto W340  [DIP762W50P254L977H451Q8]
U7  Opto W340  [DIP762W50P254L977H451Q8]
U8  Opto W340  [DIP762W50P254L977H451Q8]
U9  Opto W340  [DIP762W50P254L977H451Q8]
U10  Opto W340  [DIP762W50P254L977H451Q8]
U11  ACPL-W346-000E  [SOIC127P1150X360-6N]
U12  Opto W340  [DIP762W50P254L977H451Q8]
U13  Opto W340  [DIP762W50P254L977H451Q8]
U14  Opto W340  [DIP762W50P254L977H451Q8]
U15  Opto W340  [DIP762W50P254L977H451Q8]
U19  Opto W340  [DIP762W50P254L977H451Q8]
U21  Opto W340  [DIP762W50P254L977H451Q8]
U22  Opto W340  [DIP762W50P254L977H451Q8]
U23  Opto W340  [DIP762W50P254L977H451Q8]
U27  LM258  [DIP794W45P254L959H508Q8]
U29  617A-3  [OPTO TRANSISTOR_SOP-4]
U30  4318  [SOP 8]
V1  650V/40A  [TO-3P]
V2  650V/80A  [TO-3P]
V3  650V/80A  [TO-3P]
V4  650V/40A  [TO-3P]
V5  650V/80A  [TO-3P]
V6  650V/80A  [TO-3P]
V7  650V/80A  [TO-3P]
V8  650V/80A  [TO-3P]
V11  650V/40A  [TO-3P]
V12  650V/40A  [TO-3P]

## Ports
+5V (out, see INV.ControlMCU[1D], INV.Main[1D], INV.Main[3A], INV.Main[3D], INV.Main[4A], INV.Power[1D], INV.Power[6C]), +5V (out, see INV.ControlMCU[1D], INV.Main[1D], INV.Main[3A], INV.Main[3D], INV.Power[1D], INV.Power[6C]), +5V (out, see INV.ControlMCU[1D], INV.Main[1D], INV.Main[3A], INV.Main[4A], INV.Power[1D], INV.Power[6C]), +5V (out, see INV.ControlMCU[1D], INV.Main[1D], INV.Main[3D], INV.Main[4A], INV.Power[1D], INV.Power[6C]), +5VF (out, see INV.ControlMCU[1D], INV.ControlMCU[8C], INV.ControlMCU[9C], INV.ControlMCU[11C], INV.Main[1D]), +5VF (out, see INV.ControlMCU[1D], INV.ControlMCU[8C], INV.ControlMCU[9C], INV.ControlMCU[11C], INV.Main[1D], INV.Main[3D]), J1-1 (out, see INV.Main[1D]), J1-2 (out, see INV.Main[1D]), J1-3 (out, see INV.Main[1D]), J1-3 (out, see INV.Main[3A]), J1-4 (out, see INV.Main[1D]), J1-4 (out, see INV.Main[3A]), J1-6 (out, see INV.Main[1D]), J1-6 (out, see INV.Main[3C]), J1-7 (in, see INV.Main[1D]), J1-7 (out, see INV.Main[4B]), J1-8 (in, see INV.Main[1D]), J1-8 (out, see INV.Main[4B]), J1-9 (out, see INV.Main[1D]), J1-9 (out, see INV.Main[3A]), J1-10 (out, see INV.Main[1D]), J1-10 (out, see INV.Main[3A]), J1-11 (out, see INV.Main[1D]), J1-11 (out, see INV.Main[3A]), J1-12 (out, see INV.Main[1D]), J1-12 (out, see INV.Main[3A]), J1-13 (out, see INV.Main[1D]), J1-13 (out, see INV.Main[2B]), J1-14 (out, see INV.Main[1D]), J1-14 (out, see INV.Main[2B]), J1-15 (out, see INV.Main[1D]), J1-15 (out, see INV.Main[2B]), J1-16 (out, see INV.Main[1D]), J1-16 (out, see INV.Main[2B]), J1-19 (out, see INV.Main[1D]), J1-19 (out, see INV.Main[2A]), J1-20 (out, see INV.Main[1D]), J1-20 (out, see INV.Main[2B]), J1-21 (out, see INV.Main[1D]), J1-22 (out, see INV.Main[1D]), J1-23 (out, see INV.Main[1D]), J1-24 (out, see INV.Main[1D]), J1-25 (out, see INV.Main[1D]), J1-25 (out, see INV.Main[2C]), J1-26 (out, see INV.Main[1D]), J1-27 (out, see INV.Main[1D]), J1-27 (out, see INV.Main[4B]), J1-28 (out, see INV.Main[1D]), J1-28 (out, see INV.Main[4C]), J1-29 (out, see INV.Main[1D]), J1-30 (out, see INV.Main[1D]), J1-31 (out, see INV.Main[1D]), J1-32 (out, see INV.Main[1D]), J1-33 (out, see INV.Main[1D]), J1-33 (out, see INV.Main[4A]), J1-34 (out, see INV.Main[1D]), J1-34 (out, see INV.Main[3D]), J1-36 (out, see INV.Main[1D]), J1-36 (out, see INV.Main[4A]), J1-39 (out, see INV.Main[1D]), J1-40 (out, see INV.Main[1D]), J1-40 (out, see INV.Main[2C]), J1-41 (out, see INV.Main[1D]), J1-42 (out, see INV.Main[1D]), J1-43 (out, see INV.Main[1D]), J1-44 (out, see INV.Main[1D]), J1-49 (out, see INV.Main[1D]), J1-50 (out, see INV.Main[1D]), J1_17 (in, see INV.Main[1D]), J1_17 (out, see INV.Main[2D]), J1_18 (in, see INV.Main[1D]), J1_18 (out, see INV.Main[2D]), J2-1 (out, see INV.ControlMCU[2D], INV.Main[1D]), J2-2 (out, see INV.ControlMCU[3D], INV.Main[1D]), J2-3 (out, see INV.ControlMCU[2D], INV.Main[1D]), J2-4 (out, see INV.ControlMCU[3D], INV.Main[1D]), J2-13 (out, see INV.ControlMCU[2D], INV.Main[1D]), J2-14 (out, see INV.ControlMCU[3D], INV.Main[1D]), J2-15 (out, see INV.ControlMCU[2D], INV.Main[1D]), J2-16 (out, see INV.ControlMCU[3D], INV.Main[1D]), J2-17 (out, see INV.ControlMCU[2D], INV.Main[1D]), J2-18 (out, see INV.ControlMCU[3D], INV.Main[1D]), PWM_BOOST_A (in, see INV.ControlMCU[2D], INV.Main[1D]), PWM_BOOST_A (out, see INV.ControlMCU[2D], INV.Main[2B]), PWM_BOOST_B (in, see INV.ControlMCU[3D], INV.Main[1D]), PWM_BOOST_B (out, see INV.ControlMCU[3D], INV.Main[3B]), PWM_DAB_A (in, see INV.ControlMCU[3D], INV.ControlMCU[11D], INV.Main[1B], INV.Main[1D]), PWM_DAB_A (out, see INV.ControlMCU[3D], INV.ControlMCU[11D], INV.Main[1B]), PWM_DAB_B (in, see INV.ControlMCU[2D], INV.ControlMCU[11C], INV.Main[1B], INV.Main[1D]), PWM_DAB_B (out, see INV.ControlMCU[2D], INV.ControlMCU[11C], INV.Main[1B]), PWM_DAB_C (in, see INV.ControlMCU[3D], INV.ControlMCU[11C], INV.Main[1D], INV.Main[2B]), PWM_DAB_C (out, see INV.ControlMCU[3D], INV.ControlMCU[11C], INV.Main[2B]), PWM_DAB_D (in, see INV.ControlMCU[2D], INV.ControlMCU[11C], INV.Main[1D], INV.Main[2B]), PWM_DAB_D (out, see INV.ControlMCU[2D], INV.ControlMCU[11C], INV.Main[2B]), PWM_HERIC_A (in, see INV.ControlMCU[2D], INV.ControlMCU[9C], INV.Main[1D]), PWM_HERIC_A (out, see INV.ControlMCU[2D], INV.ControlMCU[9C], INV.Main[4B]), PWM_HERIC_B (in, see INV.ControlMCU[3D], INV.ControlMCU[9C], INV.Main[1D]), PWM_HERIC_B (out, see INV.ControlMCU[3D], INV.ControlMCU[9C], INV.Main[4B]), PWM_MPPT (in, see INV.ControlMCU[3D], INV.Main[1D]), PWM_MPPT (out, see INV.ControlMCU[3D], INV.Main[4D]), PWM_Sine_A (in, see INV.ControlMCU[2D], INV.ControlMCU[9C], INV.Main[1D], INV.Main[3B]), PWM_Sine_A (out, see INV.ControlMCU[2D], INV.ControlMCU[9C], INV.Main[3B]), PWM_Sine_B (in, see INV.ControlMCU[3D], INV.ControlMCU[9D], INV.Main[1D], INV.Main[3B]), PWM_Sine_B (out, see INV.ControlMCU[3D], INV.ControlMCU[9D], INV.Main[3B])

## Nets
-5V_DR1: C?#13.2 C?#35.1 C?#54.2 C?#74.1 C?#108.2 C?#109.2 C?#114.1 C?#115.1 C?#116.1 R?#115.2 T6.16 U6.5(VEE) U12.5(VEE)
-5V_DR2: C?#18.2 C?#36.1 C?#38.1 C?#45.2 C?#81.2 C?#82.2 C?#87.1 C?#88.1 C?#89.1 R?#111.2 T6.22 U7.5(VEE) U21.5(VEE)
-5V_DR3: C83.1 C138.2 C140.1 C?#55.2 C?#56.2 C?#75.1 C?#76.1 C?#90.2 C?#91.2 C?#99.1 C?#100.1 C?#101.1 C?#128.1 R?#112.2 T6.19 U8.5(VEE) U13.5(VEE) U22.5(VEE) U23.5(VEE)
-5V_DR4: C?#29.1 C?#30.1 C?#123.1 C?#124.1 C?#125.1 U19.5(VEE)
G_DR1: *?#4.1(A) C?#19.2 C?#28.2 C?#35.2 C?#64.2 C?#69.2 C?#74.2 C?#110.2 C?#111.2 C?#112.2 C?#113.2 C?#114.2 C?#115.2 C?#116.2 L1B.1 R284.2 R?#26.2 R?#90.2 R?#115.1 V2.3(E) V6.2(C) V8.3(E)
G_DR2: *#2.1(A) C?#20.2 C?#27.2 C?#36.2 C?#38.2 C?#42.2 C?#44.2 C?#83.2 C?#84.2 C?#85.2 C?#86.2 C?#87.2 C?#88.2 C?#89.2 L1A.1 R319.2 R?#29.2 R?#53.2 R?#111.1 V3.3(E) V5.3(E) V7.2(C)
G_DR4: *?#5.1(A) C?#21.2 C?#29.2 C?#37.1 C?#119.2 C?#120.2 C?#121.2 C?#122.2 C?#123.2 C?#124.2 C?#125.2 L6.2 R?#8.2 R?#122.1 V11.3(E) V12.2(C)
G_LLC_A: *?#10.1(A) C57.2 C61.2 C325.2 C326.2 C?#11.2 C?#12.2 C?#34.1 C?#39.2 C?#40.2 C?#43.2 C?#159.2 C?#160.2 C?#161.2 C?#162.2 C?#163.2 C?#164.2 C?#165.2 QH1.3(E) QH8.2(C) R?#51.2 R?#131.1
G_LLC_B: *?#9.1(A) C?#4.2 C?#5.2 C?#25.1 C?#32.2 C?#33.2 C?#41.2 C?#150.2 C?#151.2 C?#152.2 C?#153.2 C?#154.2 C?#155.2 C?#156.2 QH4.3(E) QH7.2(C) R?#39.2 R?#130.1 TX?.4
G_NEG: C1.2 C15.2 C20.2 C21.2 C25.2 C46.1 C107.2 C121.2 C122.1 C179.1 C321.1 C322.2 FB6.2 J1.35 J1.37 J1.38 J1.45 J1.46 J3.14 NTC1.1 NTC2.1 R313.2 U4.13(Gnd) U5.13(Gnd) U29.3
GND: FB6.1 J2.5 J2.6 J2.11 J2.12 J2.19 J2.20 J2.29 J2.30 J3.19 R?#34.1 R?#38.1 R?#40.1 R?#41.1 R?#42.1 R?#45.1 R?#50.1 R?#58.1 R?#63.1 R?#78.1 R?#80.1 R?#100.1 R?#103.1 R?#104.1 R?#107.1 R?#108.1 R?#128.1
GND_BAT: C58.2 C76.2 C150.2 C159.2 C?#46.2 C?#47.2 C?#48.2 C?#49.2 C?#50.2 C?#51.2 C?#52.2 C?#53.2 C?#67.2 C?#68.2 C?#102.2 C?#103.2 C?#104.2 C?#105.2 C?#129.1 C?#130.1 C?#131.1 C?#132.1 C?#133.1 C?#134.1 C?#135.1 C?#136.1 C?#137.1 C?#138.1 L5B.2 P5.3 P5.4 Q?#9.2(C) Q?#10.2(C) QL5.3(S) QL6.3(S) R60.2 R68.2 R229.2 R333.2 R?#86.2 R?#87.2 T2.8 T3.8 U11.4(VEE) U14.5(VEE) U27.3(+INA) U27.4(GND) U30.2(InA-) U30.3(InA+) U30.6(InB-) U30.7(OutPutB)
LLC_A_-5V: C?#8.2 C?#9.2 C?#10.2 C?#39.1 C?#43.1 C?#157.2 C?#158.2 C?#163.1 C?#164.1 C?#165.1 Q?#6.2(C) R?#131.2 T6.1 U3.5(VEE)
LLC_B_-5V: C?#1.2 C?#2.2 C?#3.2 C?#32.1 C?#41.1 C?#148.2 C?#149.2 C?#154.1 C?#155.1 C?#156.1 Q?#4.2(C) R?#130.2 T6.7 U1.5(VEE)
LLC_CD_-5V: C52.2 C53.2 C54.2 C56.1 C59.1 C?#59.2 C?#60.2 C?#61.2 C?#78.1 C?#80.1 C?#139.2 C?#140.2 C?#145.1 C?#146.1 C?#147.1 Q4.2(C) Q?#12.2(C) R?#129.2 T6.10 U2.5(VEE) U9.5(VEE)
NEG: *?#3.1(A) *?#7.1(A) C12.2 C26.2 C34.2 C50.2 C51.2 C56.2 C59.2 C74.1 C80.1 C87.1 C140.2 C141.2 C142.2 C741.2 C?#6.2 C?#7.2 C?#62.2 C?#63.2 C?#65.2 C?#66.2 C?#70.2 C?#71.2 C?#75.2 C?#76.2 C?#77.1 C?#78.2 C?#79.2 C?#80.2 C?#92.2 C?#93.2 C?#94.2 C?#95.2 C?#99.2 C?#100.2 C?#101.2 C?#106.2 C?#107.2 C?#126.2 C?#127.2 C?#128.2 C?#141.2 C?#142.2 C?#143.2 C?#144.2 C?#145.2 C?#146.2 C?#147.2 D8.2 PV_+?#3.1 QH7.3(E) QH8.3(E) R6.2 R11.2 R49#2.2 R58.2 R176.2 R?#96.2 R?#98.2 R?#110.2 R?#112.1 R?#121.1 R?#125.1 R?#127.1 R?#129.1 V1.3(E) V4.3(E) V6.3(E) V7.3(E) V12.3(E)
PE: C33.1
VS1: C79.2 C114.2 C115.2 C116.2 C117.2 C120.2 C?#96.2 Q14.2(C) QL3.3(S) QL5.2(D) R?#48.2 T2.6 TX?.3 U10.5(VEE)
VS2: C?#14.2 C?#15.2 C?#16.2 C?#17.2 C?#31.2 C?#97.2 C?#98.2 Q?#5.2(C) QL2.3(S) QL6.2(D) R?#49.2 T3.6 TX?.1 U15.5(VEE)
+5V: C15.1 C20.1 C21.1 C25.1 C46.2 C321.2 FB4.1 J3.15 J3.16 R211.1 R303.1 U4.14(Vcc) U5.14(Vcc) ; port +5V
+5VF: FB4.2 J1.47 J1.48 ; port +5VF
+15V_DAB_A: C114.1 C115.1 C116.1 C117.1 C120.1 C?#96.1 D12#2.2(K) R112.1 R130.1 U10.8(VCC) ; off-sheet +15V_DAB_A
+15V_DAB_B: C?#14.1 C?#15.1 C?#16.1 C?#17.1 C?#97.1 C?#98.1 D19.2(K) R?#6.1 R?#7.1 U15.8(VCC) ; off-sheet +15V_DAB_B
+15V_DAB_C: C150.1 C?#46.1 C?#47.1 C?#48.1 C?#49.1 C?#102.1 C?#103.1 D14.2(K) D33.1(A1) R213.1 R?#59.1 R?#60.1 U11.6(VCC) U27.8(V+) ; off-sheet +15V_DAB_C
+15V_DAB_D: C?#50.1 C?#51.1 C?#52.1 C?#53.1 C?#104.1 C?#105.1 D21.2(K) R?#61.1 R?#62.1 U14.8(VCC) ; off-sheet +15V_DAB_D
+15V_DR1: *?#4.2(K) C?#13.1 C?#19.1 C?#54.1 C?#64.1 C?#108.1 C?#109.1 C?#110.1 C?#111.1 C?#112.1 C?#113.1 D77.2(K) U6.8(VCC) U12.8(VCC) ; off-sheet +15V_DR1
+15V_DR2: *#2.2(K) C?#18.1 C?#20.1 C?#44.1 C?#45.1 C?#81.1 C?#82.1 C?#83.1 C?#84.1 C?#85.1 C?#86.1 D80.2(K) U7.8(VCC) U21.8(VCC) ; off-sheet +15V_DR2
+15V_DR3: *?#3.2(K) C83.2 C87.2 C138.1 C141.1 C?#55.1 C?#56.1 C?#65.1 C?#66.1 C?#90.1 C?#91.1 C?#92.1 C?#93.1 C?#94.1 C?#95.1 D79.2(K) U8.8(VCC) U13.8(VCC) U22.8(VCC) U23.8(VCC) ; off-sheet +15V_DR3
+15V_DR4: *?#5.2(K) C?#30.2 C?#37.2 C?#117.1 C?#118.1 C?#119.1 C?#120.1 C?#121.1 C?#122.1 D75.2(K) U19.8(VCC) ; off-sheet +15V_DR4
+15V_LLC_A: *?#10.2(K) C?#8.1 C?#9.1 C?#10.1 C?#11.1 C?#12.1 C?#157.1 C?#158.1 C?#159.1 C?#160.1 C?#161.1 C?#162.1 D25.2(K) R?#4.1 R?#5.1 U3.8(VCC) ; off-sheet +15V_LLC_A
+15V_LLC_B: *?#9.2(K) C?#1.1 C?#2.1 C?#3.1 C?#4.1 C?#5.1 C?#148.1 C?#149.1 C?#150.1 C?#151.1 C?#152.1 C?#153.1 D26.2(K) R?#2.1 R?#3.1 U1.8(VCC) ; off-sheet +15V_LLC_B
+15V_LLC_CD: *?#7.2(K) C50.1 C51.1 C52.1 C53.1 C54.1 C?#59.1 C?#60.1 C?#61.1 C?#62.1 C?#63.1 C?#139.1 C?#140.1 C?#141.1 C?#142.1 C?#143.1 C?#144.1 D28.2(K) R40.1 R124.1 R?#72.1 R?#73.1 U2.8(VCC) U9.8(VCC) ; off-sheet +15V_LLC_CD
BAT +48: C?#129.2 C?#130.2 C?#131.2 C?#132.2 C?#133.2 C?#134.2 C?#135.2 C?#136.2 C?#137.2 C?#138.2 L5A.2 P5.1 P5.2 QL2.2(D) QL3.2(D) R60.1 R198#1.1 R212.1 R331.2 ; off-sheet BAT +48
BUS +: C?#6.1 C?#7.1 C?#106.1 C?#107.1 D1.3(K) PV_+?#1.1 R314.2 R?#113.2 V2.2(C) V3.2(C) V11.2(C) ; off-sheet BUS +
J1-1: J1.1 J3.1 ; port J1-1
J1-2: J1.2 J3.2 ; port J1-2
J1-3: J1.3 R317.2 ; port J1-3
J1-4: J1.4 R14.2 ; port J1-4
J1-6: C322.1 J1.6 R211.2 U29.4 ; port J1-6
J1-7: J1.8 R255.2 ; port J1-7
J1-8: J1.7 R260.2 ; port J1-8
J1-10: J1.9 J1.10 R49#1.2 ; port J1-9, port J1-10
J1-11: J1.11 J1.12 R43.1 ; port J1-11, port J1-12
J1-13: J1.13 J1.15 L?.3 R3.1 R7.1 ; port J1-13, port J1-15
J1-14: J1.14 J1.16 L?.4 R3.2 R7.2 ; port J1-14, port J1-16
J1-19: J1.19 R276.2 ; port J1-19
J1-20: J1.20 R10.2 ; port J1-20
J1-21: J1.21 J3.4 ; port J1-21
J1-22: J1.22 J3.3 ; port J1-22
J1-23: J1.23 J3.10 ; port J1-23
J1-24: J1.24 J3.9 ; port J1-24
J1-25: J1.25 NTC1.2 ; port J1-25
J1-26: J1.26 J3.11 ; port J1-26
J1-27: J1.27 R277.2 ; port J1-27
J1-28: J1.28 R321.2 ; port J1-28
J1-29: J1.29 J3.6 ; port J1-29
J1-30: J1.30 J3.5 ; port J1-30
J1-31: J1.31 J3.7 ; port J1-31
J1-32: J1.32 J3.8 ; port J1-32
J1-33: J1.33 R?#1.1 ; port J1-33
J1-34: C179.2 J1.34 R303.2 R313.1 ; port J1-34
J1-36: J1.36 R414.1 ; port J1-36
J1-39: J1.39 J3.12 ; port J1-39
J1-40: J1.40 NTC2.2 ; port J1-40
J1-41: J1.41 J3.22 ; port J1-41
J1-42: J1.42 J3.24 ; port J1-42
J1-43: J1.43 J1.44 J3.13 ; port J1-43, port J1-44
J1-49: J1.49 J1.50 J3.17 ; port J1-49, port J1-50
J1_17: J1.17 R296.1 ; port J1_17
J1_18: J1.18 R305.1 ; port J1_18
J2-1: J2.1 J3.21 ; port J2-1
J2-2: J2.2 J3.28 ; port J2-2
J2-3: J2.3 J3.20 ; port J2-3
J2-4: J2.4 J3.18 ; port J2-4
J2-13: J2.13 J3.25 ; port J2-13
J2-14: J2.14 J3.23 ; port J2-14
J2-15: J2.15 J3.27 ; port J2-15
J2-16: J2.16 J3.26 ; port J2-16
J2-17: J2.17 J3.30 ; port J2-17
J2-18: J2.18 J3.29 ; port J2-18
PWM_BOOST_A: J2.9 R?#47.1 ; port PWM_BOOST_A
PWM_BOOST_B: J2.10 R?#65.1 ; port PWM_BOOST_B
PWM_DAB_A: J2.22 R?#17.1 R?#68.1 ; port PWM_DAB_A
PWM_DAB_B: J2.21 R?#18.1 R?#66.1 ; port PWM_DAB_B
PWM_DAB_C: J2.24 R?#9.1 R?#89.1 ; port PWM_DAB_C
PWM_DAB_D: J2.23 R?#13.1 R?#88.1 ; port PWM_DAB_D
PWM_HERIC_A: J2.27 R?#57.1 ; port PWM_HERIC_A
PWM_HERIC_B: J2.26 R?#83.1 ; port PWM_HERIC_B
PWM_MPPT: J2.8 R?#118.2 ; port PWM_MPPT
PWM_Sine_A: J2.25 R?#10.1 R?#77.1 ; port PWM_Sine_A
PWM_Sine_B: J2.28 R?#11.1 R?#76.1 ; port PWM_Sine_B
Net*#1_1: *#1.1 C12.1
Net*?#1_1: *?#1.1 C11.1
Net*?#2_1: *?#2.1 C26.1
Net*?#6_1: *?#6.1 C62.1 C77.2
Net*?#8_1: *?#8.1 C58.1 C76.1
Net?#1_1: ?#1.1 C62.2 C68.2 C69.2 L5A.1
Net?#2_1: ?#2.1 C68.1 C69.1 C77.1 L5B.1
NetC1_1: C1.1 R49#1.1 U5.11(Vfef)
NetC11_2: C11.2 C29.1 H#2.1 L1B.2 R257.2
NetC29_2: C29.2 C33.2 H#1.1 R252.2 U4.2(Out)
NetC34_1: C34.1 R50.1
NetC57_1: C57.1 C61.1 C325.1 C326.1 L?.1
NetC74_2: C74.2 Q3.1(B) Q4.1(B) R42.1
NetC79_1: C79.1 Q13.1(B) Q14.1(B) R115.1
NetC80_2: C80.2 R68.1
NetC107_1: C107.1 R43.2 U5.12(Vout)
NetC121_1: C121.1 R?#1.2 U4.11(Vfef)
NetC122_2: C122.2 R414.2 U4.12(Vout)
NetC142_1: C142.1 R177.2
NetC159_1: C159.1 R198#2.2 R229.1 R417.1
NetC741_1: C741.1 QH1.2(C) QH4.2(C) R67.2 R273.2 U5.1(In)
NetC?#21_1: C?#21.1 R?#22.2
NetC?#22_1: C?#22.1 R?#9.2 R?#15.2 U1.2(A)
NetC?#22_2: C?#22.2 R?#15.1 R?#34.2 U1.3(C)
NetC?#23_1: C?#23.1 R?#18.2 R?#27.2 U15.2(A)
NetC?#23_2: C?#23.2 R?#27.1 R?#42.2 U15.3(C)
NetC?#24_1: C?#24.1 R?#17.2 R?#30.1 U10.2(A)
NetC?#24_2: C?#24.2 R?#30.2 R?#41.2 U10.3(C)
NetC?#25_2: C?#25.2 Q?#1.1(B) Q?#4.1(B) R?#12.1
NetC?#26_1: C?#26.1 R?#13.2 R?#32.2 U3.2(A)
NetC?#26_2: C?#26.2 R?#32.1 R?#45.2 U3.3(C)
NetC?#27_1: C?#27.1 R?#28.2
NetC?#28_1: C?#28.1 R?#25.2
NetC?#31_1: C?#31.1 Q?#2.1(B) Q?#5.1(B) R?#19.1
NetC?#33_1: C?#33.1 R?#31.1
NetC?#34_2: C?#34.2 Q?#3.1(B) Q?#6.1(B) R?#21.1
NetC?#40_1: C?#40.1 R?#44.1
NetC?#42_1: C?#42.1 R?#54.2
NetC?#57_1: C?#57.1 R?#66.2 R?#70.2 U11.1(ANODE)
NetC?#57_2: C?#57.2 R?#70.1 R?#78.2 U11.3(CATHODE)
NetC?#58_1: C?#58.1 R?#68.2 R?#71.2 U14.2(A)
NetC?#58_2: C?#58.2 R?#71.1 R?#80.2 U14.3(C)
NetC?#67_1: C?#67.1 Q?#8.1(B) Q?#10.1(B) R?#69.1
NetC?#68_1: C?#68.1 Q?#7.1(B) Q?#9.1(B) R?#67.1
NetC?#69_1: C?#69.1 R?#91.2
NetC?#70_1: C?#70.1 R?#97.2
NetC?#71_1: C?#71.1 R?#95.2
NetC?#72_1: C?#72.1 R?#88.2 R?#101.2 U2.2(A)
NetC?#72_2: C?#72.2 R?#101.1 R?#107.2 U2.3(C)
NetC?#73_1: C?#73.1 R?#89.2 R?#102.2 U9.2(A)
NetC?#73_2: C?#73.2 R?#102.1 R?#108.2 U9.3(C)
NetC?#77_2: C?#77.2 Q?#11.1(B) Q?#12.1(B) R?#99.1
NetC?#79_1: C?#79.1 R?#106.1
NetC?#117_2: C?#117.2 C?#118.2 R?#122.2 T6.13
NetC?#126_1: C?#126.1 R?#126.1
NetC?#127_1: C?#127.1 R?#123.1
NetD1_1: D1.1(A1) D1.2(A2) L16.2 V1.2(C) V4.2(C)
NetD8_1: D8.1 R?#117.1 R?#121.2
NetD11_1: D11.1(A) D12#1.1(A) D78.1(A1) D78.2(A2) J?.2
NetD11_2: D11.2(K) T2.4
NetD12#1_2: D12#1.2(K) T3.4
NetD12#2_1: D12#2.1(A) T2.5
NetD14_1: D14.1(A) T2.7
NetD19_1: D19.1(A) T3.5
NetD21_1: D21.1(A) T3.7
NetD25_1: D25.1(A) T6.2
NetD26_1: D26.1(A) T6.8
NetD28_1: D28.1(A) T6.11
NetD33_2: D33.2(A2) R198#1.2
NetD33_3: D33.3(K) R210.2
NetD37_1: D37.1(A1) D37.2(A2) R228.1
NetD37_3: D37.3(K) U27.7(OUTB) U29.2
NetD75_1: D75.1(A) T6.12
NetD77_1: D77.1(A) T6.15
NetD78_3: D78.3(K) T6.5
NetD79_1: D79.1(A) T6.18
NetD80_1: D80.1(A) T6.21
NetJ?_1: J?.1 T2.1 T3.1 T6.4
NetL1A_2: L1A.2 U4.1(In)
NetL6_1: L6.1 U5.2(Out)
NetL16_1: L16.1 PV_+?#2.1
NetL?_2: L?.2 TX?.6
NetQ3_2: Q3.2(C) R40.2 R124.2
NetQ3_3: Q3.3(E) Q4.3(E) R50.2 R54.2 R55.2
NetQ13_2: Q13.2(C) R112.2 R130.2
NetQ13_3: Q13.3(E) Q14.3(E) R114.2 R118.2
NetQ?#1_2: Q?#1.2(C) R?#2.2 R?#3.2
NetQ?#1_3: Q?#1.3(E) Q?#4.3(E) R?#20.2 R?#31.2 R?#35.2
NetQ?#2_2: Q?#2.2(C) R?#6.2 R?#7.2
NetQ?#2_3: Q?#2.3(E) Q?#5.3(E) R?#33.2 R?#43.2
NetQ?#3_2: Q?#3.2(C) R?#4.2 R?#5.2
NetQ?#3_3: Q?#3.3(E) Q?#6.3(E) R?#37.2 R?#44.2 R?#46.2
NetQ?#7_2: Q?#7.2(C) R?#59.2 R?#60.2
NetQ?#7_3: Q?#7.3(E) Q?#9.3(E) R?#74.2 R?#79.2
NetQ?#8_2: Q?#8.2(C) R?#61.2 R?#62.2
NetQ?#8_3: Q?#8.3(E) Q?#10.3(E) R?#75.2 R?#81.2
NetQ?#11_2: Q?#11.2(C) R?#72.2 R?#73.2
NetQ?#11_3: Q?#11.3(E) Q?#12.3(E) R?#105.2 R?#106.2 R?#109.2
NetQH1_1: QH1.1(G) R?#37.1 R?#46.1 R?#51.1
NetQH4_1: QH4.1(G) R?#20.1 R?#35.1 R?#39.1
NetQH7_1: QH7.1(G) R49#2.1 R54.1 R55.1
NetQH8_1: QH8.1(G) R?#105.1 R?#109.1 R?#110.1
NetQL2_1: QL2.1(G) R?#33.1 R?#43.1 R?#49.1
NetQL3_1: QL3.1(G) R114.1 R118.1 R?#48.1
NetQL5_1: QL5.1(G) R?#74.1 R?#79.1 R?#86.1
NetQL6_1: QL6.1(G) R?#75.1 R?#81.1 R?#87.1
NetR6_1: R6.1 R8.2
NetR8_1: R8.1 R9.2
NetR9_1: R9.1 R10.1
NetR11_1: R11.1 R12.2
NetR12_1: R12.1 R13.2
NetR13_1: R13.1 R14.1
NetR42_2: R42.2 U2.6(VO1) U2.7(VO2)
NetR58_1: R58.1 R59.1
NetR59_2: R59.2 R62.1
NetR62_2: R62.2 R67.1
NetR115_2: R115.2 U10.6(VO1) U10.7(VO2)
NetR168_1: R168.1 R176.1 R177.1 V12.1(G)
NetR168_2: R168.2 U23.6(VO1) U23.7(VO2)
NetR198#2_1: R198#2.1 R220.2
NetR210_1: R210.1 R416.1 U30.1(OutPutA) U30.8(Vcc)
NetR212_2: R212.2 R220.1
NetR213_2: R213.2 U29.1
NetR228_2: R228.2 R416.2 U27.5(+INB)
NetR252_1: R252.1 R253.1
NetR253_2: R253.2 R254.1
NetR254_2: R254.2 R255.1
NetR257_1: R257.1 R258.1
NetR258_2: R258.2 R259.1
NetR259_2: R259.2 R260.1
NetR273_1: R273.1 R274.2
NetR274_1: R274.1 R275.2
NetR275_1: R275.1 R276.1
NetR277_1: R277.1 R278.1
NetR278_2: R278.2 R318.1
NetR284_1: R284.1 R285.1
NetR285_2: R285.2 R320.1
NetR296_2: R296.2 R297.1
NetR297_2: R297.2 R298.1
NetR298_2: R298.2 R299.1
NetR299_2: R299.2 R330.1
NetR305_2: R305.2 R306.1
NetR306_2: R306.2 R307.1
NetR307_2: R307.2 R308.1
NetR308_2: R308.2 R332.1
NetR314_1: R314.1 R315.2
NetR315_1: R315.1 R316.2
NetR316_1: R316.1 R317.1
NetR318_2: R318.2 R319.1
NetR320_2: R320.2 R321.1
NetR330_2: R330.2 R331.1
NetR332_2: R332.2 R333.1
NetR417_2: R417.2 U27.6(-INB)
NetR?#8_1: R?#8.1 R?#22.1 R?#36.1 V11.1(G)
NetR?#10_2: R?#10.2 R?#24.2 U21.2(A)
NetR?#11_2: R?#11.2 R?#23.2 U12.2(A)
NetR?#12_2: R?#12.2 U1.6(VO1) U1.7(VO2)
NetR?#14_1: R?#14.1 R?#25.1 R?#26.1 V2.1(G)
NetR?#14_2: R?#14.2 U12.6(VO1) U12.7(VO2)
NetR?#16_1: R?#16.1 R?#28.1 R?#29.1 V3.1(G)
NetR?#16_2: R?#16.2 U21.6(VO1) U21.7(VO2)
NetR?#19_2: R?#19.2 U15.6(VO1) U15.7(VO2)
NetR?#21_2: R?#21.2 U3.6(VO1) U3.7(VO2)
NetR?#23_1: R?#23.1 R?#38.2 U12.3(C)
NetR?#24_1: R?#24.1 R?#40.2 U21.3(C)
NetR?#36_2: R?#36.2 U19.6(VO1) U19.7(VO2)
NetR?#47_2: R?#47.2 R?#52.2 U23.2(A)
NetR?#50_2: R?#50.2 R?#55.1 U7.3(C)
NetR?#52_1: R?#52.1 R?#58.2 U23.3(C)
NetR?#53_1: R?#53.1 R?#54.1 R?#56.1 V5.1(G)
NetR?#55_2: R?#55.2 R?#57.2 U7.2(A)
NetR?#56_2: R?#56.2 U7.6(VO1) U7.7(VO2)
NetR?#63_2: R?#63.2 R?#64.1 U19.3(C)
NetR?#64_2: R?#64.2 R?#65.2 U19.2(A)
NetR?#67_2: R?#67.2 U11.5(VOUT)
NetR?#69_2: R?#69.2 U14.6(VO1) U14.7(VO2)
NetR?#76_2: R?#76.2 R?#93.2 U13.2(A)
NetR?#77_2: R?#77.2 R?#94.2 U22.2(A)
NetR?#82_1: R?#82.1 R?#90.1 R?#91.1 V8.1(G)
NetR?#82_2: R?#82.2 U6.6(VO1) U6.7(VO2)
NetR?#83_2: R?#83.2 R?#92.2 U6.2(A)
NetR?#84_1: R?#84.1 R?#97.1 R?#98.1 V7.1(G)
NetR?#84_2: R?#84.2 U13.6(VO1) U13.7(VO2)
NetR?#85_1: R?#85.1 R?#95.1 R?#96.1 V6.1(G)
NetR?#85_2: R?#85.2 U22.6(VO1) U22.7(VO2)
NetR?#92_1: R?#92.1 R?#100.2 U6.3(C)
NetR?#93_1: R?#93.1 R?#103.2 U13.3(C)
NetR?#94_1: R?#94.1 R?#104.2 U22.3(C)
NetR?#99_2: R?#99.2 U9.6(VO1) U9.7(VO2)
NetR?#113_1: R?#113.1 R?#114.2
NetR?#114_1: R?#114.1 R?#116.2
NetR?#116_1: R?#116.1 R?#117.2
NetR?#118_1: R?#118.1 R?#124.2 U8.2(A)
NetR?#119_1: R?#119.1 R?#120.1 U8.6(VO1) U8.7(VO2)
NetR?#119_2: R?#119.2 R?#123.2 R?#125.2 V4.1(G)
NetR?#120_2: R?#120.2 R?#126.2 R?#127.2 V1.1(G)
NetR?#124_1: R?#124.1 R?#128.2 U8.3(C)
NetT2_2: T2.2 T2.3
NetT3_2: T3.2 T3.3
NetU27_1: U27.1(OUTA) U27.2(-INA)
NetV5_2: V5.2(C) V8.2(C)

Not connected (* = marked no-connect by the designer): J1 5*; J2 7; U30 4(VEE/Gnd) 5(InB+)

## Layout directives
mark named ?: NetR210_1, NetU30_4, NetU30_5
mark named Check: NetJ2_7

## Notes on the sheet
- Title:
- NOTE:
- Size:
- Date:
- Uplate:
- Number:
- Time:
- Revision:
- (in symbol LM358N/NOPB) A; B
- (in symbol Tranf7) W1; W2
- (in symbol Tranf10) 5V; 0V; 12V; 300V

## Library data of the parts
*#1 *?#1 *?#2 *?#6 *?#8 ?#1 ?#2 H#1 H#2 PV_+?#1-PV_+?#3 = Copper
C1 C11 C12 C20 C25 C26 C33 C34 C46 C50-C54 C56 C59 C74 C79 C80 C83 C87 C107 C114-C117 C121 C122 C138 C140-C142 C150 C159 C179 C321 C322 C?#1-C?#5 C?#8-C?#80 C?#82-C?#89 C?#91-C?#96 C?#98-C?#102 C?#105 C?#109-C?#117 C?#119-C?#128 C?#139 C?#141-C?#148 C?#150-C?#157 C?#159-C?#165 = Tu dan gom: Tu khong phan cuc; Value: 0.47uF
C15 C21 C?#81 C?#90 C?#108 C?#118 C?#140 C?#149 C?#158 = Cap - 10x18 - N: Cắm 100uF 25V; Don_Vi: Con; So_Chan: 2; Ten_Linh_Kien: Tụ Hóa 220uF 10V 6x11MM; Ma_Hang: MH004510; Chung_Loai: Cắm; Kieu_Chan: *
C29 = ECWFG2J475KA: EMI (MKP) - B32924; MF: Panasonic; Value: *; Price: None; Package: MOLDED-2 Panasonic; MP: ECWFG2J475KA; Availability: In Stock; Check_prices: https://www.snapeda.com/parts/ECWFG2J475KA/Panasonic/view-part/?ref=eda; SnapEDA_Link: https://www.snapeda.com/parts/ECWFG2J475KA/Panasonic/view-part/?ref=snap
C57 C61 C325 C326 = ECWFG2J475KA: Metallized Polypropylene Film Capacitor; MF: Panasonic; Value: *; Price: None; Package: MOLDED-2 Panasonic; MP: ECWFG2J475KA; Availability: In Stock; Check_prices: https://www.snapeda.com/parts/ECWFG2J475KA/Panasonic/view-part/?ref=eda; SnapEDA_Link: https://www.snapeda.com/parts/ECWFG2J475KA/Panasonic/view-part/?ref=snap
C58 C62 C76 C77 = CC0603JRNPO9BN910: CAP CER 91PF 50V 5% COG/NPO 0603; Solder: SMT; CompanyID: VT-01341; Value: 91pF/50V; MPN: CC0603JRNPO9BN910; Category: CAPACITOR; PinCount: 2
C68 C69 C?#129-C?#138 = CC0603JRNPO9BN910: Cap Film; Solder: SMT; CompanyID: VT-01341; Value: 91pF/50V; MPN: CC0603JRNPO9BN910; Category: CAPACITOR; PinCount: 2
C120 C?#6 C?#7 C?#97 C?#103 C?#104 C?#106 C?#107 = Cap - 10x18 - N: Cắm; Don_Vi: Con; So_Chan: 2; Ten_Linh_Kien: Tụ Hóa 220uF 10V 6x11MM; Ma_Hang: MH004510; Chung_Loai: Cắm; Kieu_Chan: *
C741 = Cap - 10x18 - N: capacitor E256238; Chung_Loai: Cắm; Don_Vi: Con; So_Chan: 2; Ten_Linh_Kien: Tụ Hóa 220uF 10V 6x11MM; Ma_Hang: MH004510; Kieu_Chan: *
D1 = Diode Double: 600V/30A STTH30AC06 TO3P-3L; MP: STTH2003CG-TR; Package: None; Price: None; Value: *; Availability: Unavailable
D8 = LED: LED Single colour Green and Red; Value: LED 3 ly Single Colour
D11 D12#1 D12#2 D14 D19 D21 D25 D26 D28 D75 D77 D79 D80 = DIODE: Diode 600V 2A thay the ES2J; Value: 1N4007
D33 = Diode Double: MP: STTH2003CG-TR; Package: None; Price: None; Value: *; Availability: Unavailable
D37 = Diode Double: STTH2003 Series Dual 10 A 1 V 35 ns Secondary Rectifier Surface Mount - D2PAK; MP: STTH2003CG-TR; Package: None; Price: None; Value: *; Availability: Unavailable
D78 = Diode Double: 200V/5A TO-252 MURD520; MP: STTH2003CG-TR; Package: None; Price: None; Value: *; Availability: Unavailable
FB4 FB6 = RC0603FR-0775RL: RES SMD 75 OHM 1% 1/10W 0603; Solder: SMT; Value: 75R; MPN: RC0603FR-0775RL; Category: RESISTOR; PinCount: 2
J1 = Header 25x2: Header, 25x2-Pin 2.5mm; LatestRevisionDate: 17-Jul-2002; LatestRevisionNote: Re-released for DXP Platform.; Publisher: Altium Limited
J2 J3 = Header 15x2: Header, 15x2-Pin 2.5mm; LatestRevisionDate: 17-Jul-2002; LatestRevisionNote: Re-released for DXP Platform.; Publisher: Altium Limited
J? NTC1 NTC2 = Jump2
L1A L1B L5A L5B L6 = IND_18uH-0.12A-10%-SMD: Fixed Inductors 18uH 10% 2.52MHz; Manufacturer: Wurth Electronics; Manufacturer Part Number: CMH322522-180KL; Alternate Part Number-1: NA; Case/Package: SMD; Supplier-1: ARROW; Supplier Part Number-1: CMH322522-180KL
L16 = CUON CAM PWM Hybrid: Cuận cảm bộ sạc PWM Hybrid; Value: Loc 220; Designed by: VanDungEvn
L? = Bien ap dong: Biến áp đo dòng; Value: Loc 220; Designed by: VanDungEvn
P5 = Header 4P 2.54 Duc Thang: Cắm; Ten_Linh_Kien: Header 4P XH2.54-4P Đực Thẳng; Don_Vi: Con; Ma_Hang: MH001285; Chung_Loai: Cắm
Q3 Q?#1 Q?#3 Q?#11 = D882M: NPN 40V/2A PBSS4240T
Q4 Q?#4 Q?#6 Q?#12 = B772M-PNP: PNP 40V/2A PBSS5240T; Value: C9015
Q13 Q?#2 Q?#7 Q?#8 = D882M: thay the D882
Q14 Q?#5 Q?#9 Q?#10 = B772M-PNP: thay the B772; Value: C9015
QH1 QH4 QH7 QH8 = FGA25N120ANTD: IGBT NPT IKW50N65EH5 thay the xang IKW50N65ET7; MF: ON Semiconductor; Value: *; Digi-Key_Purchase_URL: https://www.digikey.in/product-detail/en/on-semiconductor/FGA25N120ANTDTU/FGA25N120ANTDTU-ND/820640?utm_source=snapeda&utm_medium=aggregator&utm_campaign=symbol; MP: FGA25N120ANTD; Package: TO-3 Fairchild Semiconductor; SnapEDA_Link: https://www.snapeda.com/parts/FGA25N120ANTD/ON%20Semiconductor/view-part/202622/?ref=snap; Digi-Key_Part_Number: FGA25N120ANTDTU-ND
QL2 QL3 QL5 QL6 = MOSFET IRF N: N-channel mosfet IRFP4468PBF; Value: IRF840
R3 R7 R49#2 R60 R68 R176 R177 R198#1 R198#2 R210-R213 R220 R228 R229 R296-R299 R303 R305-R308 R313 R330-R333 R416 R417 R?#8-R?#11 R?#13 R?#15 R?#17 R?#18 R?#22-R?#30 R?#32 R?#34 R?#38-R?#42 R?#45 R?#47-R?#55 R?#57 R?#58 R?#63-R?#66 R?#68 R?#70 R?#71 R?#76-R?#78 R?#80 R?#83 R?#86-R?#98 R?#100-R?#104 R?#107 R?#108 R?#110-R?#112 R?#115 R?#118 R?#121-R?#131 = R dan: Resistor 0805; Manufacturer: Generic Components; Class: Passive; Published: 08/06/2000; Publisher: Altium Hobart Technology Centre
R6 R8-R14 R40 R42 R50 R54 R55 R58 R59 R62 R67 R112 R114 R115 R118 R124 R130 R168 R252-R255 R257-R260 R273-R278 R284 R285 R314-R321 R?#2-R?#7 R?#12 R?#14 R?#16 R?#19-R?#21 R?#31 R?#33 R?#35-R?#37 R?#43 R?#44 R?#46 R?#56 R?#59-R?#62 R?#67 R?#69 R?#72-R?#75 R?#79 R?#81 R?#82 R?#84 R?#85 R?#99 R?#105 R?#106 R?#109 R?#119 R?#120 = R dan: Resistor 1206; Manufacturer: Generic Components; Class: Passive; Published: 08/06/2000; Publisher: Altium Hobart Technology Centre
R43 R49#1 R414 R?#1 = R dan: Resistor 0603; Manufacturer: Generic Components; Class: Passive; Published: 08/06/2000; Publisher: Altium Hobart Technology Centre
R?#113 R?#114 R?#116 R?#117 = R dan: Resistor 2010; Manufacturer: Generic Components; Class: Passive; Published: 08/06/2000; Publisher: Altium Hobart Technology Centre
T2 = Tranfomer EE13: Designed by: VanDungEvn; Value: BAX
T3 = Tranf10: Value: BA xung
T6 = Transfomer EE28: MP: 14A-10R-10; Package: None; Price: None; Value: *; Availability: Unavailable
TX? = Tranf7: Off-Line Transformer WE-UNIT , L=2.8mH; PartNo: 7491181012; Manufacturer: Würth Elektronik eiSos GmbH; Inductance: 2.8mH; Turns Ratio: 8.1:1; Input Voltage (AC): 85-265; Output Current (A): 0.25; Output Voltage (DC): 12; ComponentLink1Description: Manufacturer; ComponentLink1URL: http://www.we-online.de; Created by: Otto Christin; Created Date: OCT 2013; ComponentLink2Description: Datasheet; ComponentLink2URL: http://www.we-online.de/katalog/media/pdf/7491181012.pdf
U1-U3 U6-U10 U12-U15 U19 U21-U23 = Opto VO3120-X001: 2.5A Gate Driver Optical Coupling 5300Vrms 1 Channel 8-DIP; MF: Vishay Semiconductor; Package: DIP-8 Vishay Semiconductor; MP: VO3120-X001; Value: *; Availability: Unavailable; SnapEDA_Link: https://www.snapeda.com/parts/VO3120-X001/Vishay%20Semiconductor%20Opto%20Division/view-part/653157/?ref=snap; Price: None
U4 U5 = Current sensor: Bien dong sinomags STB-CAS/R; Value: Loc 220; Designed by: VanDungEvn
U11 = ACPL-W346-000E: 2.5A Gate Driver Optical Coupling 5000Vrms 1 Channel 6-SO Stretched; MF: Broadcom Limited; Package: SOIC-6 Broadcom; Availability: Unavailable; MP: ACPL-W346-000E; Value: *; SnapEDA_Link: https://www.snapeda.com/parts/ACPL-W346-000E/Broadcom%20Limited/view-part/2767622/?ref=snap; Price: None
U27 = LM358N/NOPB: MF: Texas Instruments; SnapEDA_Link: https://www.snapeda.com/parts/LM358N/NOPB/Texas+Instruments/view-part/?ref=snap; Package: PDIP-8 Texas; MP: LM358N/NOPB; Check_prices: https://www.snapeda.com/parts/LM358N/NOPB/Texas+Instruments/view-part/?ref=eda; Purchase-URL: https://pricing.snapeda.com/search/part/LM358N/NOPB/?ref=eda; Price: None; Value: *; Availability: In Stock
U29 = VOM617A-2T: OPTOISOLATOR 3.75KV TRANS 4-SOP; Solder: SMT; CompanyID: VT-xxxx; MPN: VOM617A-2T; Value: VOM617A-2T
U30 = LM358 SOP8: Dán; Ma_Hang: MH000609; Don_Vi: Con; Ten_Linh_Kien: LM358 SOP8; Kieu_Chan: *; Ghi_Chu: *; Chung_Loai: Dán
V1 V4 V11 V12 = FGA25N120ANTD: IGBT NPT G40H65DFB ST; MF: ON Semiconductor; Value: *; Digi-Key_Purchase_URL: https://www.digikey.in/product-detail/en/on-semiconductor/FGA25N120ANTDTU/FGA25N120ANTDTU-ND/820640?utm_source=snapeda&utm_medium=aggregator&utm_campaign=symbol; MP: FGA25N120ANTD; Package: TO-3 Fairchild Semiconductor; SnapEDA_Link: https://www.snapeda.com/parts/FGA25N120ANTD/ON%20Semiconductor/view-part/202622/?ref=snap; Digi-Key_Part_Number: FGA25N120ANTDTU-ND
V2 V3 V5-V8 = FGA25N120ANTD: IGBT NPT STGWA80H65DFB; MF: ON Semiconductor; Value: *; Digi-Key_Purchase_URL: https://www.digikey.in/product-detail/en/on-semiconductor/FGA25N120ANTDTU/FGA25N120ANTDTU-ND/820640?utm_source=snapeda&utm_medium=aggregator&utm_campaign=symbol; MP: FGA25N120ANTD; Package: TO-3 Fairchild Semiconductor; SnapEDA_Link: https://www.snapeda.com/parts/FGA25N120ANTD/ON%20Semiconductor/view-part/202622/?ref=snap; Digi-Key_Part_Number: FGA25N120ANTDTU-ND